# Altium project DspControlBoard.PrjPcb
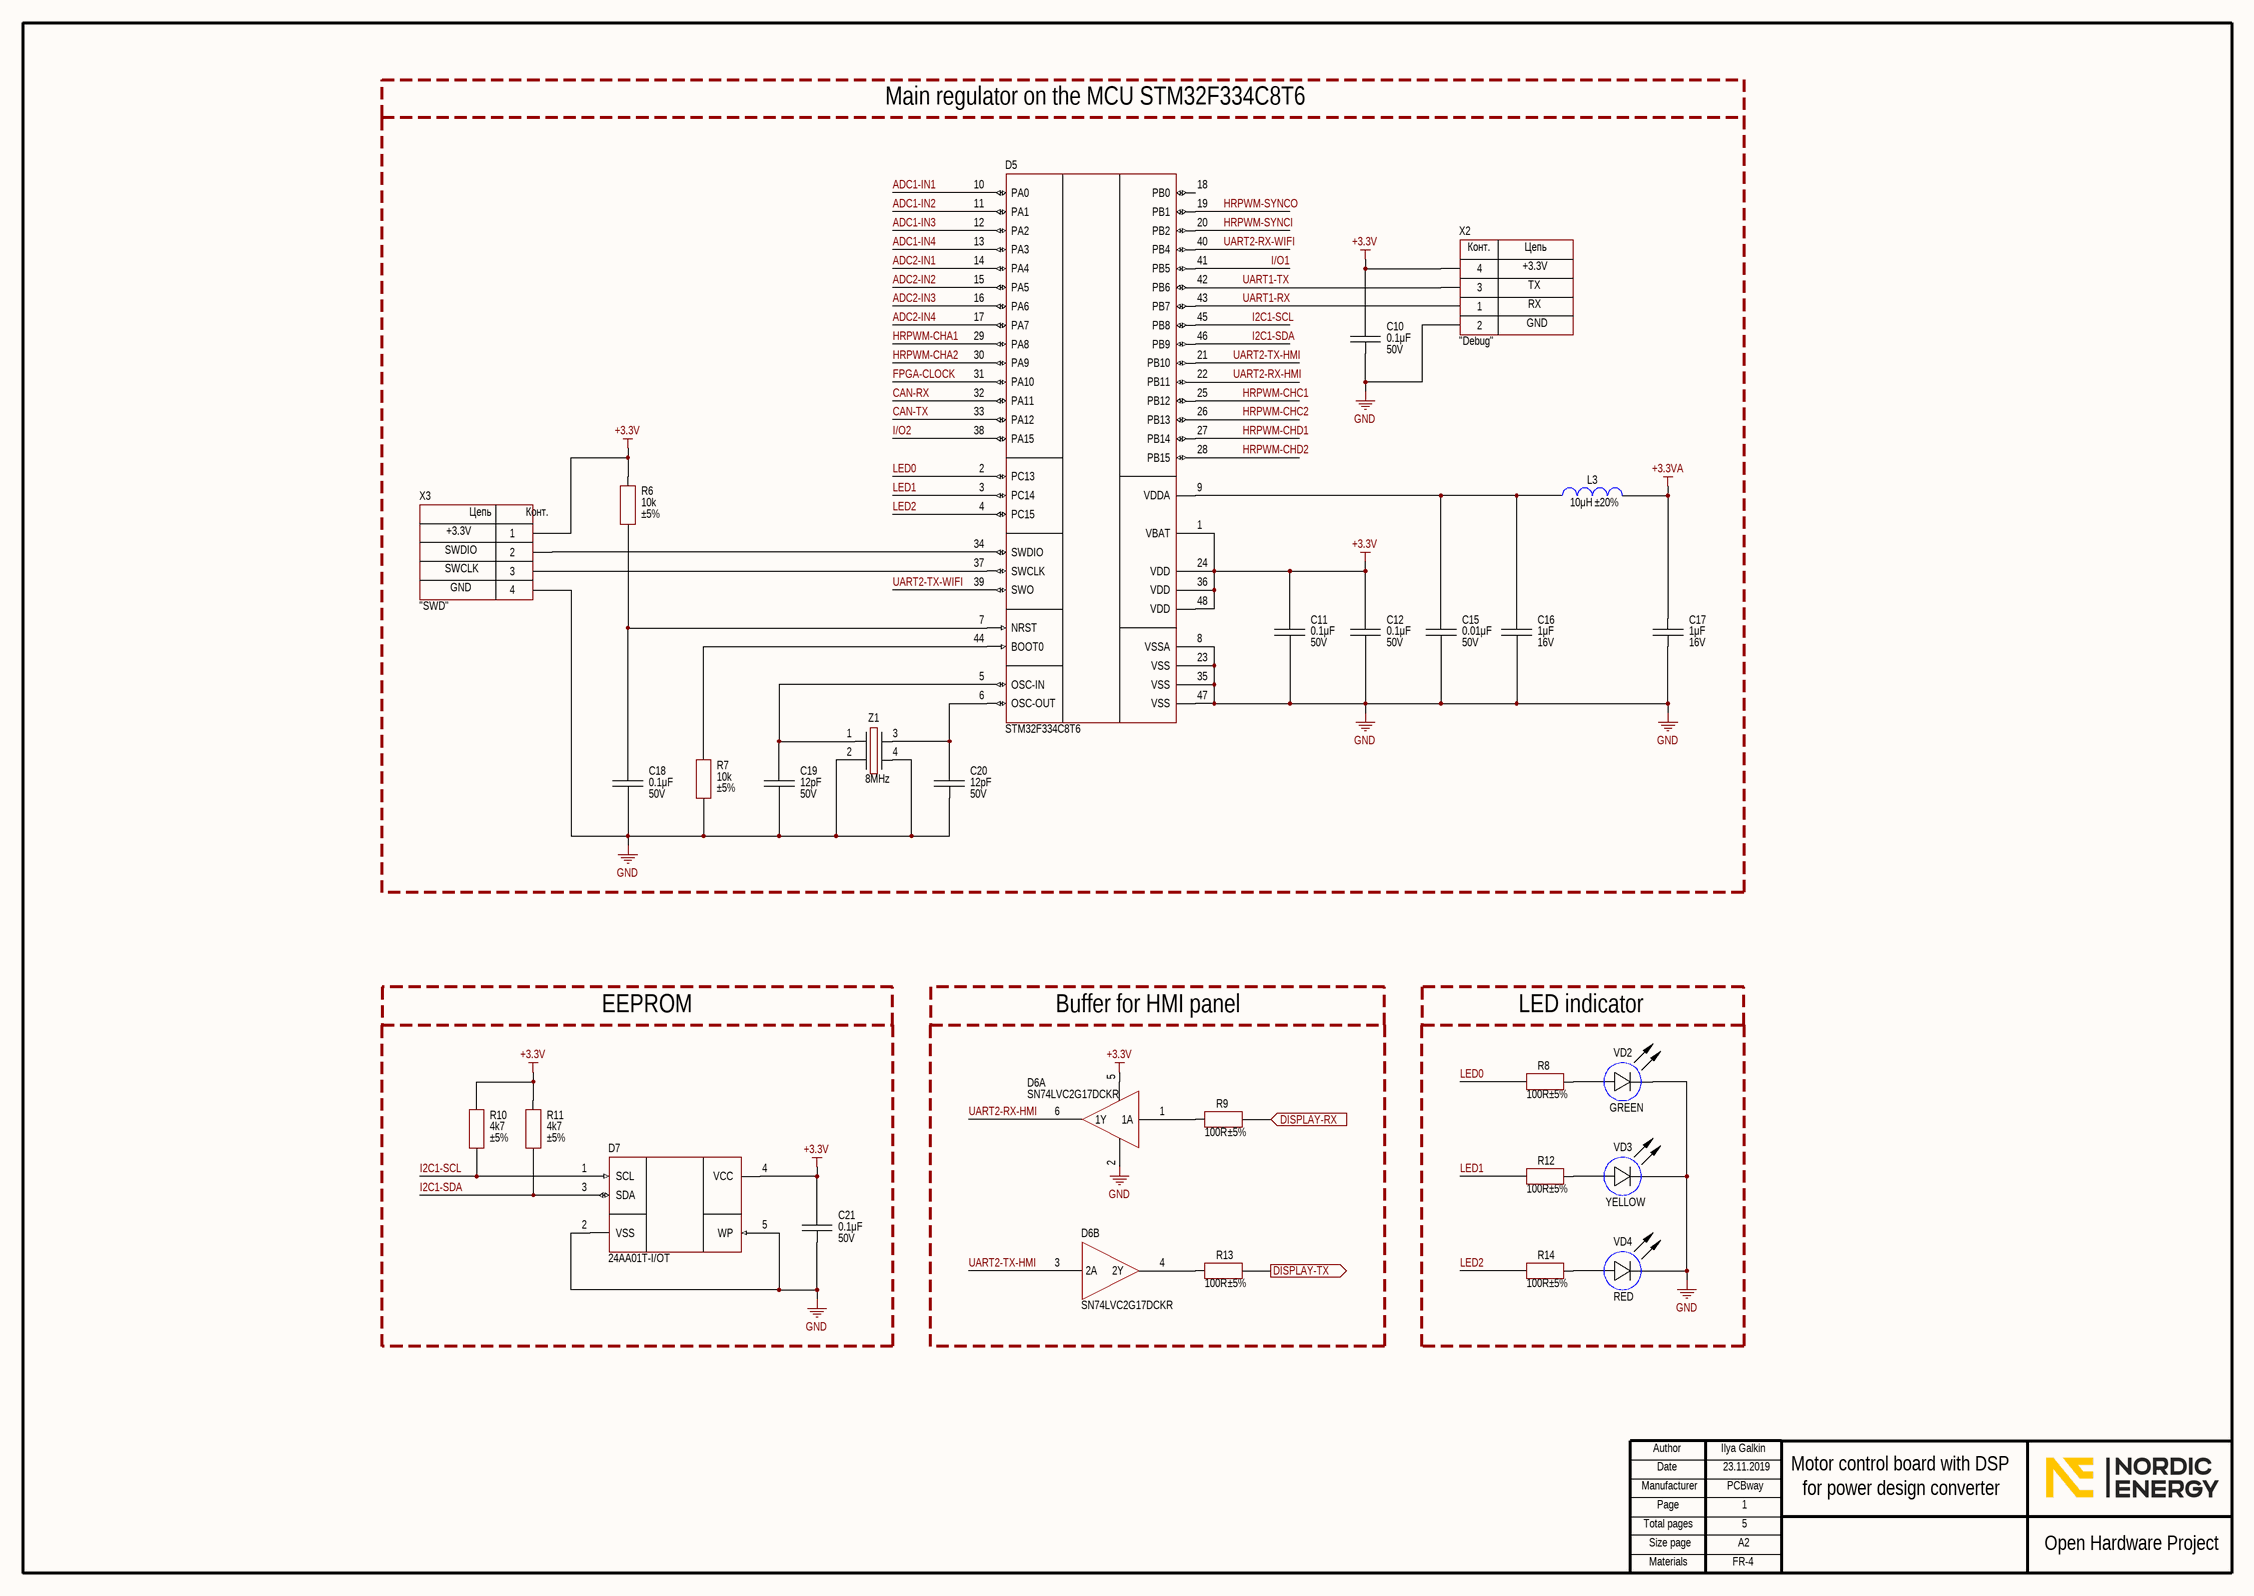
[diagram p0: ControllerDSP.SchDoc]
5 sheets, 113 parts. Net scope: global (net labels, ports and power ports of the same name join across sheets).
Board file: PcbFotControlBoard.PcbDoc
Sheets:
  ControllerDSP.SchDoc
  ProtectionADC.SchDoc
  WiFi.SchDoc
  ProtectionCPLD.SchDoc
  CanAndSupply.SchDoc

## Sheet ControllerDSP.SchDoc
size 594 x 420 mm; Address1: Address1; Address2: Address2; Address3: Address3; Address4: Address4; DocumentNumber: АБВГ.123456.001 Э3; SheetNumber: 1; SheetTotal: 5; Scale: 1:1; DocumentType: Схема электрическая принципиальная; FirstReferrence: АБВГ.123456.001

### Parts
C10  value 0.1μF  Voltage: 50V  [CAP: 0603]
C11  value 0.1μF  Voltage: 50V  [CAP: 0603]
C12  value 0.1μF  Voltage: 50V  [CAP: 0603]
C15  value 0.01μF  Voltage: 50V  [CAP: 0603]
C16  value 1μF  Voltage: 16V  [CAP: 0603]
C17  value 1μF  Voltage: 16V  [CAP: 0603]
C18  value 0.1μF  Voltage: 50V  [CAP: 0603]
C19  value 12pF  Voltage: 50V  [CAP: 0603]
C20  value 12pF  Voltage: 50V  [CAP: 0603]
C21  value 0.1μF  Voltage: 50V  [CAP: 0603]
D5  (no value)  [48-LQFP]
D6  (no value)  [SC70-6]  (parts A,B of 2)
D7  PartNumber: 24AA01T-I/OT  [SOT23-5]
L3  value 10μH  Tolerance: ±20%  [IND: 0603]
R6  value 10k  Tolerance: ±5%  [RES: 0603]
R7  value 10k  Tolerance: ±5%  [RES: 0603]
R8  value 100R  Tolerance: ±5%  [RES: 0603]
R9  value 100R  Tolerance: ±5%  [RES: 0603]
R10  value 4k7  Tolerance: ±5%  [RES: 0603]
R11  value 4k7  Tolerance: ±5%  [RES: 0603]
R12  value 100R  Tolerance: ±5%  [RES: 0603]
R13  value 100R  Tolerance: ±5%  [RES: 0603]
R14  value 100R  Tolerance: ±5%  [RES: 0603]
VD2  Color: GREEN  [LED: 0603G]
VD3  Color: YELLOW  [LED: 0603Y]
VD4  Color: RED  [LED: 0603R]
X2  CommentText: "Debug"  [CON: PBD-4]
X3  CommentText: "SWD"  [CON: SM04B-GHS]
Z1  Frequency: 8MHz  [OSC: 3225]

### Blocks framed on the sheet
Main regulator on the MCU STM32F334C8T6: C10-C12 C15-C20 D5 L3 R6 R7 X2 X3 Z1
EEPROM: C21 D7 R10 R11
Buffer for HMI panel: D6 R9 R13
LED indicator: R8 R12 R14 VD2-VD4

### Ports
DISPLAY-RX (in), DISPLAY-TX (out)

### Nets
+3.3V: C10.2 C11.2 C12.2 C21.2 D5.1(VBAT) D5.24(VDD) D5.36(VDD) D5.48(VDD) D6.5 D7.4(VCC) R6.2 R10.2 R11.2 X2.4 X3.1
+3.3VA: C17.2 L3.1
GND: C10.1 C11.1 C12.1 C15.1 C16.1 C17.1 C18.1 C19.1 C20.1 C21.1 D5.8(VSSA) D5.23(VSS) D5.35(VSS) D5.47(VSS) D6.2 D7.2(VSS) D7.5(WP) R7.1 VD2.2(C) VD3.2(C) VD4.2(C) X2.2 X3.4 Z1.2 Z1.4
ADC1-IN1: D5.10(PA0)
ADC1-IN2: D5.11(PA1)
ADC1-IN3: D5.12(PA2)
ADC1-IN4: D5.13(PA3)
ADC2-IN1: D5.14(PA4)
ADC2-IN2: D5.15(PA5)
ADC2-IN3: D5.16(PA6)
ADC2-IN4: D5.17(PA7)
CAN-RX: D5.32(PA11)
CAN-TX: D5.33(PA12)
FPGA-CLOCK: D5.31(PA10)
HRPWM-CHA1: D5.29(PA8)
HRPWM-CHA2: D5.30(PA9)
HRPWM-CHC1: D5.25(PB12)
HRPWM-CHC2: D5.26(PB13)
HRPWM-CHD1: D5.27(PB14)
HRPWM-CHD2: D5.28(PB15)
HRPWM-SYNCI: D5.20(PB2)
HRPWM-SYNCO: D5.19(PB1)
I2C1-SCL: D5.45(PB8) D7.1(SCL) R10.1
I2C1-SDA: D5.46(PB9) D7.3(SDA) R11.1
I/O1: D5.41(PB5)
I/O2: D5.38(PA15)
LED0: D5.2(PC13) R8.1
LED1: D5.3(PC14) R12.1
LED2: D5.4(PC15) R14.1
UART1-RX: D5.43(PB7) X2.1
UART1-TX: D5.42(PB6) X2.3
UART2-RX-HMI: D5.22(PB11) D6.6(1Y)
UART2-RX-WIFI: D5.40(PB4)
UART2-TX-HMI: D5.21(PB10) D6.3(2A)
UART2-TX-WIFI: D5.39(SWO)
NetC15_2: C15.2 C16.2 D5.9(VDDA) L3.2
NetC18_2: C18.2 D5.7(NRST) R6.1
NetC19_2: C19.2 D5.5(OSC-IN) Z1.1
NetC20_2: C20.2 D5.6(OSC-OUT) Z1.3
NetD5_34: D5.34(SWDIO) X3.2
NetD5_37: D5.37(SWCLK) X3.3
NetD5_44: D5.44(BOOT0) R7.2
NetD6_1: D6.1(1A) R9.1
NetD6_4: D6.4(2Y) R13.1
NetR8_2: R8.2 VD2.1(A)
NetR9_2: R9.2 ; port DISPLAY-RX
NetR12_2: R12.2 VD3.1(A)
NetR13_2: R13.2 ; port DISPLAY-TX
NetR14_2: R14.2 VD4.1(A)

Not connected (* = marked no-connect by the designer): D5 18(PB0)

### Notes on the sheet
- SWDIO
- +3.3V
- SWCLK
- GND
- Ilya Galkin
- 23.11.2019
- PCBway
- 1
- Motor control board with DSP
- for power design converter
- 5
- FR-4
- Author
- Manufacturer
- Date
- Page
- Total pages
- Size page
- A2
- Open Hardware Project
- Materials
- (in symbol Connector_SM04B) Цепь; Конт.
- (in symbol Standard_Debug) Конт.; Цепь; +3.3V; TX; RX; GND

### Library data of the parts
C10-C12 C18 C21 = Ceramic_0603: Manufacturer: Samsung; PartNumber: CL10B104KB8NNNC; ValueManufacturerPartNumber: Ceramic capacitor, 0.1μF, X7R, ±10%, 50V, 0603, -55...+125°C; TypeCapacitor: Ceramic capacitor; Tolerance: ±10%; TypeDielectric: X7R; Package: 0603; HelpURL: https://www.digikey.com/product-detail/en/samsung-electro-mechanics/CL10B104KB8NNNC/1276-1000-1-ND/3889086; Temperature: -55...+125°C
C15 = Ceramic_0603: Manufacturer: Samsung; PartNumber: CL10B103KB8NNNC; ValueManufacturerPartNumber: Ceramic capacitor, 0.01μF, X7R, ±10%, 50V, 0603, -55...+125°C; TypeCapacitor: Ceramic capacitor; Tolerance: ±10%; TypeDielectric: X7R; Package: 0603; HelpURL: https://www.digikey.com/product-detail/en/samsung-electro-mechanics/CL10B103KB8NNNC/1276-1009-1-ND/3889095; Temperature: -55...+125°C
C16 C17 = Ceramic_0603: Manufacturer: Samsung; PartNumber: CL10B105KO8NNNC; ValueManufacturerPartNumber: Ceramic capacitor, 1μF, X7R, ±10%, 16V, 0603, -55...+125°C; TypeCapacitor: Ceramic capacitor; Tolerance: ±10%; TypeDielectric: X7R; Package: 0603; HelpURL: https://www.digikey.com/product-detail/en/samsung-electro-mechanics/CL10B105KO8NNNC/1276-1019-1-ND/3889105; Temperature: -55...+125°C
C19 C20 = Ceramic_0603: Manufacturer: Samsung; PartNumber: CL10C120JB8NNNC; ValueManufacturerPartNumber: Ceramic capacitor, 12pF, NPO, ±10%, 50V, 0603, -55...+125°C; TypeCapacitor: Ceramic capacitor; Tolerance: ±10%; TypeDielectric: NPO; Package: 0603; HelpURL: https://www.digikey.com/product-detail/en/samsung-electro-mechanics/CL10C120JB8NNNC/1276-1254-1-ND/3889340; Temperature: -55...+125°C
D5 = STM32F334C8T6: Cortex-M4; Manufacturer: STMicroelectronics; ValueManufacturerPartNumber: IC microcontroller, 32-Bit, Cortex-M4, 72MHz, 64KB, 12KB, 2...3.6V, -40...+85°C, 48-LQFP; Supply: 2...3.6V; Speed: 72MHz; CoreSize: 32-Bit; MemoryROM: 64KB; MemoryRAM: 12KB; HelpURL: https://www.digikey.com/products/en?keywords=STM32F334C8T6; Package: 48-LQFP; ComponentType: IC microcontroller; Temperature: -40...+85°C; CoreProcessor: Cortex-M4; PartNumber: STM32F334C8T6
D6 = SN74LVC2G17DCKR: Buffer; Manufacturer: Texas Instruments; ValueManufacturerPartNumber: IC logic buffer, 1.65...5.5V, -40...+125°C, SC-70-6; Supply: 1.65...5.5V; HelpURL: https://www.digikey.com/product-detail/en/texas-instruments/SN74LVC2G17DCKR/296-13013-1-ND/479736; Package: SC-70-6; ComponentType: IC logic buffer; Temperature: -40...+125°C; PartNumber: SN74LVC2G17DCKR
D7 = 24AA01T: EEPROM; Manufacturer: Microchip Technology; ValueManufacturerPartNumber: IC memory, EEPROM, 1KB (128x8), 400 kHz, I2C, 1.7...5.5V, -40...+85°C, SOT-23-5; Supply: 1.7...5.5V; Speed: 400 kHz; InterfaceData: I2C; MemorySize: 1KB (128x8); HelpURL: https://www.digikey.com/product-detail/en/microchip-technology/24AA01T-I-OT/24AA01T-I-OTCT-ND/857670; Package: SOT-23-5; ComponentType: IC memory; Temperature: -40...+85°C; MemoryType: EEPROM
L3 = Inductor_0603: Manufacturer: Murata Electronics; PartNumber: LQM18FN100M00D; ValueManufacturerPartNumber: Fixed inductor, 10μH, ±20%, 0603, 50mA, -55...+125°C; TypeInductor: Fixed inductor; MaxCurrent: 50mA; Package: 0603; HelpURL: https://www.digikey.com/product-detail/en/murata-electronics-north-america/LQM18FN100M00D/490-4025-1-ND/1016285; Temperature: -55...+125°C
R6 R7 = Resistor_0603: Manufacturer: Yageo; PartNumber: RC0603JR-0710KL; ValueManufacturerPartNumber: Resistor film, 10k, ±5%, 0603, 0.1W, -55...+125°C; TypeResistor: Resistor film; Power: 0.1W; Package: 0603; HelpURL: https://www.digikey.com/product-detail/en/yageo/RC0603JR-0710KL/311-10KGRCT-ND/729647; Temperature: -55...+125°C
R8 R9 R12-R14 = Resistor_0603: Manufacturer: Yageo; PartNumber: RC0603JR-07100RL; ValueManufacturerPartNumber: Resistor film, 100R, ±5%, 0603, 0.1W, -55...+125°C; TypeResistor: Resistor film; Power: 0.1W; Package: 0603; HelpURL: https://www.digikey.com/product-detail/en/yageo/RC0603JR-07100RL/311-100GRCT-ND/729644; Temperature: -55...+125°C
R10 R11 = Resistor_0603: Manufacturer: Yageo; PartNumber: RC0603JR-074K7L; ValueManufacturerPartNumber: Resistor film, 4k7, ±5%, 0603, 0.1W, -55...+125°C; TypeResistor: Resistor film; Power: 0.1W; Package: 0603; HelpURL: https://www.digikey.com/product-detail/en/yageo/RC0603JR-074K7L/311-4.7KGRCT-ND/729732; Temperature: -55...+125°C
VD2 = LED_single: Manufacturer: Wurth; ValueManufacturerPartNumber: LED, Green, 20mA, 2V, 0603, -55...+150°C; PartNumber: 150060VS75000; TypeDiode: LED; Current: 20mA; VoltageDrop: 2V; Package: 0603; HelpURL: https://www.digikey.com/product-detail/en/wurth-electronics-inc/150060VS75000/732-4980-1-ND/4489904; Temperature: -55...+150°C; ColorParameter: Green
VD3 = LED_single: Manufacturer: Wurth; ValueManufacturerPartNumber: LED, Yellow, 20mA, 2V, 0603, -55...+150°C; PartNumber: 150060YS75000; TypeDiode: LED; Current: 20mA; VoltageDrop: 2V; Package: 0603; HelpURL: https://www.digikey.com/product-detail/en/wurth-electronics-inc/150060YS75000/732-4981-1-ND/4489907; Temperature: -55...+150°C; ColorParameter: Yellow
VD4 = LED_single: Manufacturer: Wurth; ValueManufacturerPartNumber: LED, Red, 20mA, 2V, 0603, -55...+150°C; PartNumber: 150060RS55040; TypeDiode: LED; Current: 20mA; VoltageDrop: 2V; Package: 0603; HelpURL: https://www.digikey.com/product-detail/en/w-rth-elektronik/150060RS55040/732-12015-1-ND/8557225; Temperature: -55...+150°C; ColorParameter: Red
X2 = Standard_Debug: Manufacturer: Connfly; ValueManufacturerPartNumber: Connector, 4pin, 2.54mm, 500VAC, 3A; PartNumber: PBD-4; TypeConnector: Connector; VoltageMax: 500VAC; Pitch: 2.54mm; CurrentMax: 3A; Multichannel: 4pin; HelpURL: https://www.chipdip.ru/product/pbd-4
X3 = Connector_SM04B: Manufacturer: JST; ValueManufacturerPartNumber: Connector, 4pin, 1.25mm, 50VDC, 1A; PartNumber: SM04B-GHS; VoltageMax: 50VDC; Pitch: 1.25mm; CurrentMax: 1A; Multichannel: 4pin; HelpURL: https://www.digikey.com/product-detail/en/jst-sales-america-inc/SM04B-GHS-TB-LF-SN/455-1566-1-ND/807834; TypeConnector: Connector
Z1 = Crystal_3225: Manufacturer: Diodes Incorporated; PartNumber: FL0800008Q; ValueManufacturerPartNumber: Crystal, 8MHz, 12pF, ±30ppm, case 3225, -40...+85°C; LoadCapacitance: 12pF; Tolerance: ±30ppm; Package: case 3225; HelpURL: https://www.digikey.com/product-detail/en/diodes-incorporated/FL0800008Q/FL0800008QDICT-ND/9952912; Temperature: -40...+85°C; TypeOscilator: Crystal

## Sheet ProtectionADC.SchDoc
size 420 x 297 mm; Address1: Address1; Address2: Address2; Address3: Address3; Address4: Address4; DocumentNumber: АБВГ.123456.001 Э3; SheetNumber: 2; SheetTotal: 5; Scale: 1:1; DocumentType: Схема электрическая принципиальная; FirstReferrence: АБВГ.123456.001
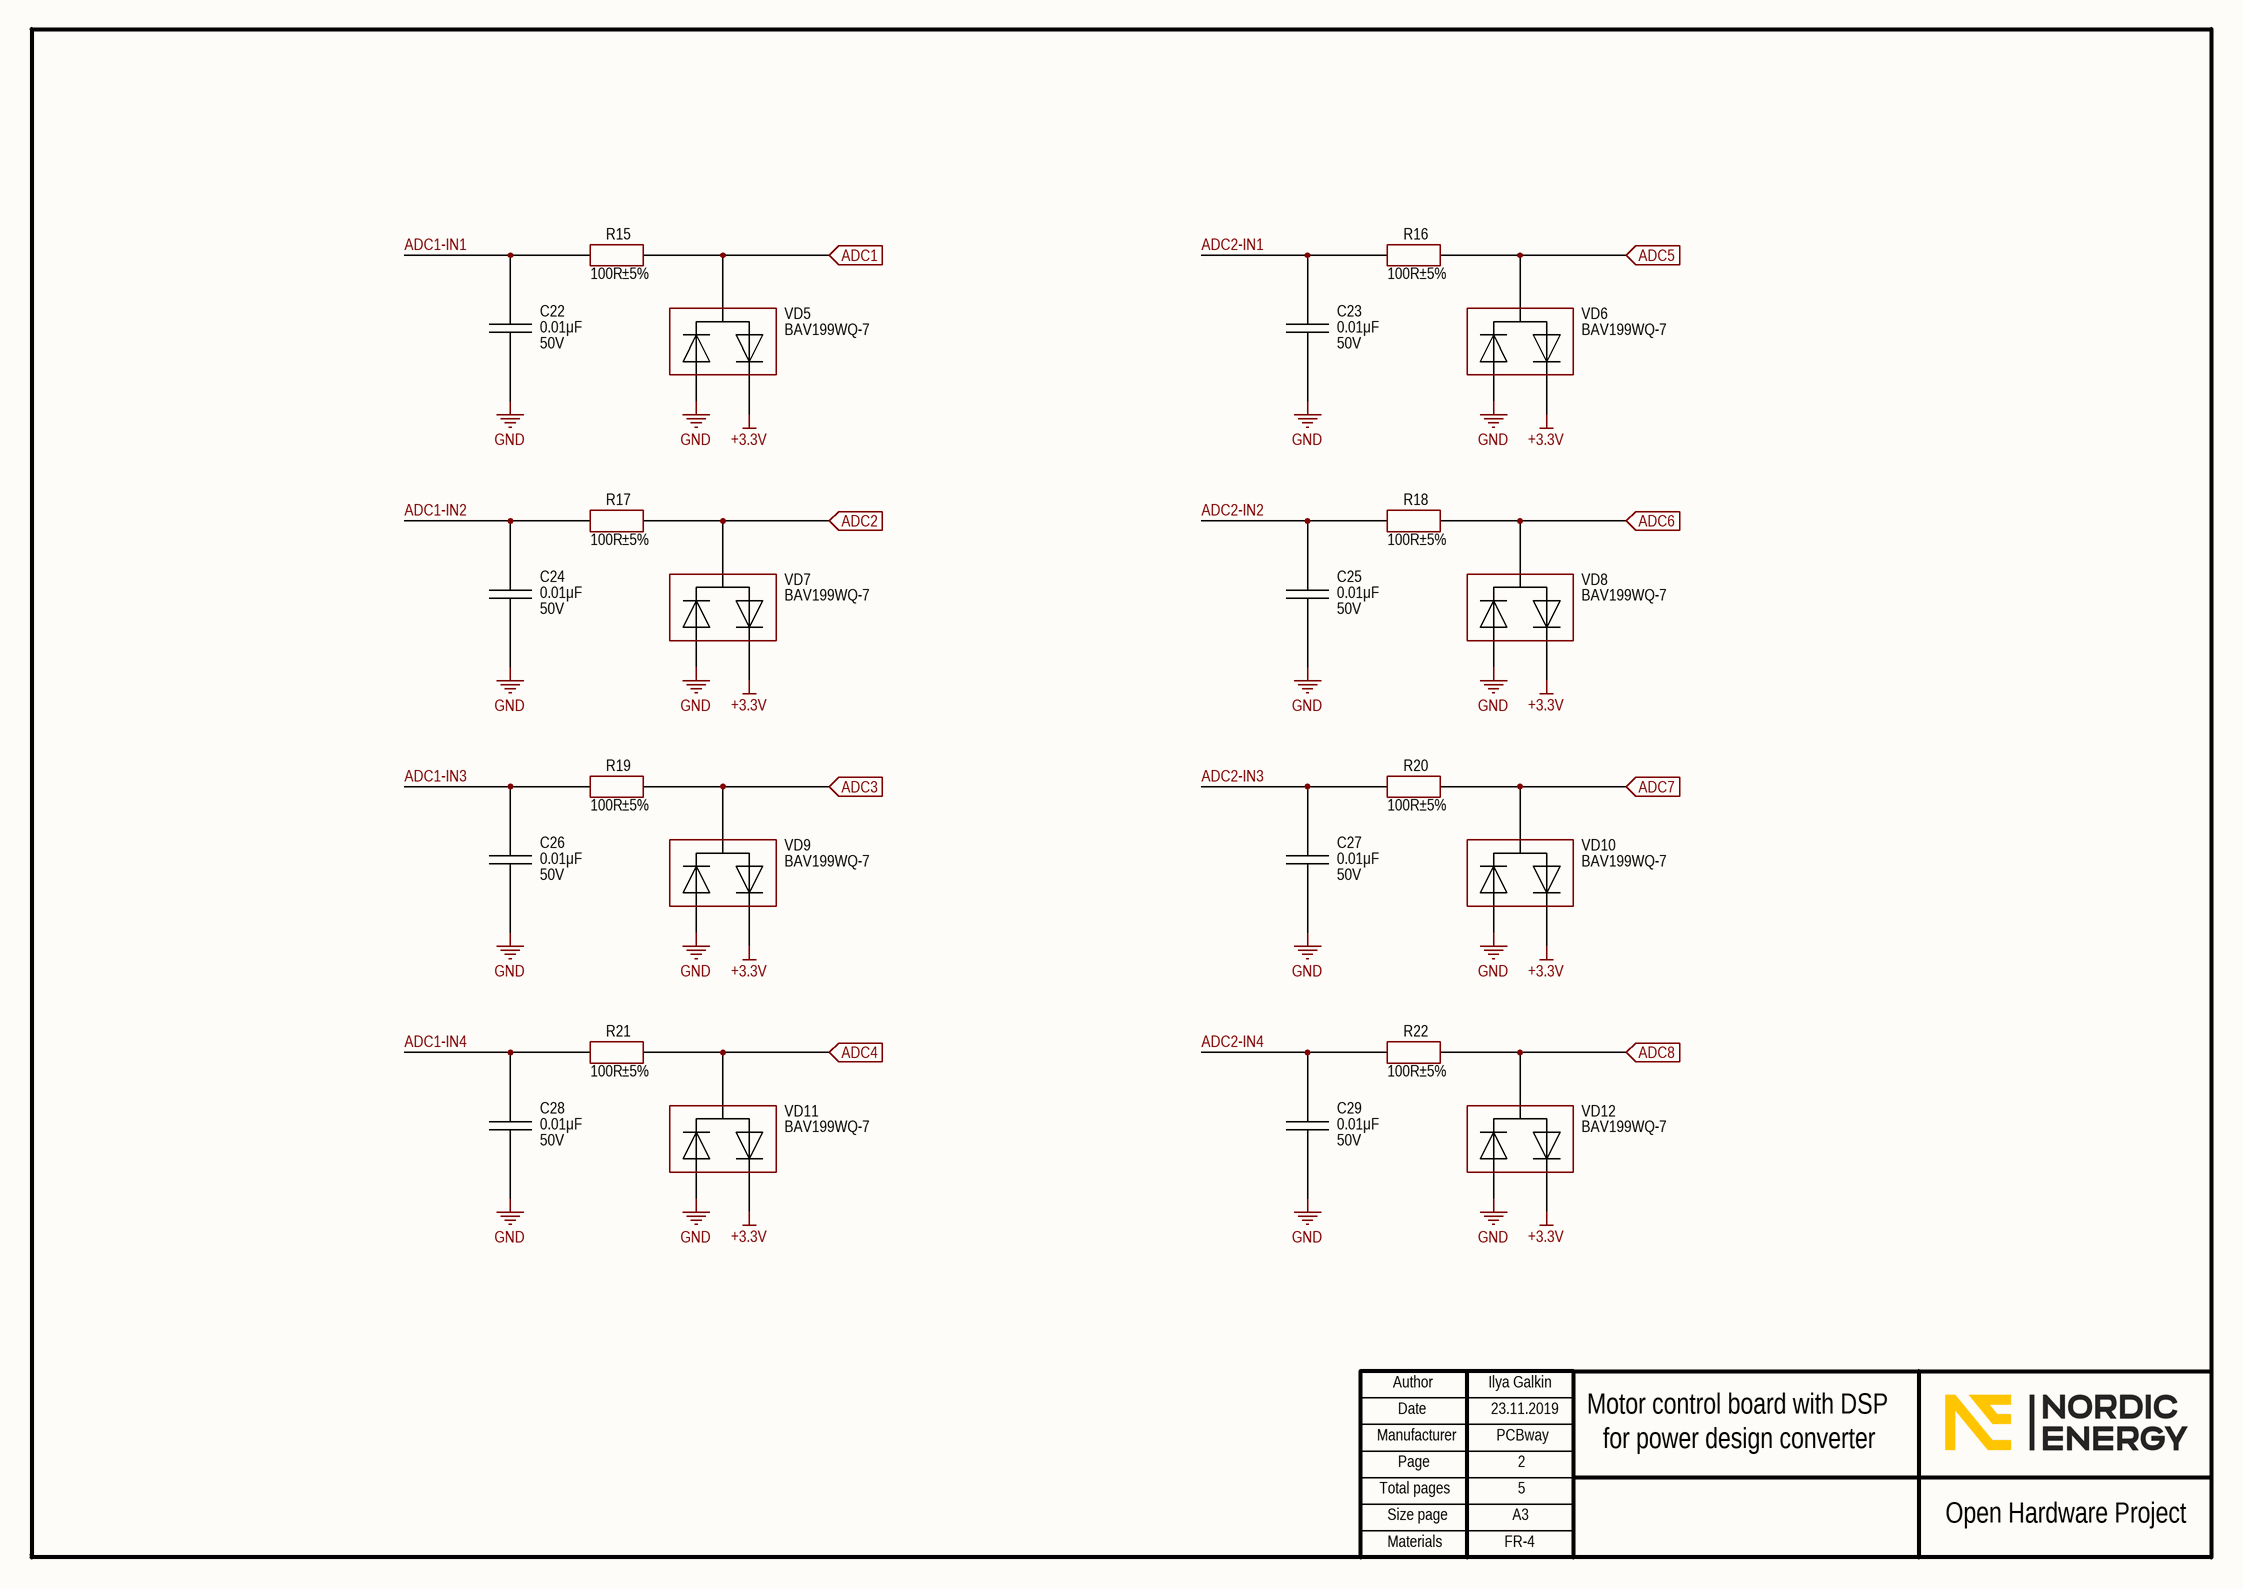
[diagram p1: ProtectionADC.SchDoc]

### Parts
C22  value 0.01μF  Voltage: 50V  [CAP: 0603]
C23  value 0.01μF  Voltage: 50V  [CAP: 0603]
C24  value 0.01μF  Voltage: 50V  [CAP: 0603]
C25  value 0.01μF  Voltage: 50V  [CAP: 0603]
C26  value 0.01μF  Voltage: 50V  [CAP: 0603]
C27  value 0.01μF  Voltage: 50V  [CAP: 0603]
C28  value 0.01μF  Voltage: 50V  [CAP: 0603]
C29  value 0.01μF  Voltage: 50V  [CAP: 0603]
R15  value 100R  Tolerance: ±5%  [RES: 0603]
R16  value 100R  Tolerance: ±5%  [RES: 0603]
R17  value 100R  Tolerance: ±5%  [RES: 0603]
R18  value 100R  Tolerance: ±5%  [RES: 0603]
R19  value 100R  Tolerance: ±5%  [RES: 0603]
R20  value 100R  Tolerance: ±5%  [RES: 0603]
R21  value 100R  Tolerance: ±5%  [RES: 0603]
R22  value 100R  Tolerance: ±5%  [RES: 0603]
VD5  PartNumber: BAV199WQ-7  [SC-70]
VD6  PartNumber: BAV199WQ-7  [SC-70]
VD7  PartNumber: BAV199WQ-7  [SC-70]
VD8  PartNumber: BAV199WQ-7  [SC-70]
VD9  PartNumber: BAV199WQ-7  [SC-70]
VD10  PartNumber: BAV199WQ-7  [SC-70]
VD11  PartNumber: BAV199WQ-7  [SC-70]
VD12  PartNumber: BAV199WQ-7  [SC-70]

### Ports
ADC1 (in), ADC2 (in), ADC3 (in), ADC4 (in), ADC5 (in), ADC6 (in), ADC7 (in), ADC8 (in)

### Nets
+3.3V: VD5.2 VD6.2 VD7.2 VD8.2 VD9.2 VD10.2 VD11.2 VD12.2
GND: C22.1 C23.1 C24.1 C25.1 C26.1 C27.1 C28.1 C29.1 VD5.1 VD6.1 VD7.1 VD8.1 VD9.1 VD10.1 VD11.1 VD12.1
ADC1-IN1: C22.2 R15.1
ADC1-IN2: C24.2 R17.1
ADC1-IN3: C26.2 R19.1
ADC1-IN4: C28.2 R21.1
ADC2-IN1: C23.2 R16.1
ADC2-IN2: C25.2 R18.1
ADC2-IN3: C27.2 R20.1
ADC2-IN4: C29.2 R22.1
NetR15_2: R15.2 VD5.3 ; port ADC1
NetR16_2: R16.2 VD6.3 ; port ADC5
NetR17_2: R17.2 VD7.3 ; port ADC2
NetR18_2: R18.2 VD8.3 ; port ADC6
NetR19_2: R19.2 VD9.3 ; port ADC3
NetR20_2: R20.2 VD10.3 ; port ADC7
NetR21_2: R21.2 VD11.3 ; port ADC4
NetR22_2: R22.2 VD12.3 ; port ADC8

### Notes on the sheet
- Ilya Galkin
- 23.11.2019
- PCBway
- 2
- Motor control board with DSP
- for power design converter
- 5
- FR-4
- Author
- Manufacturer
- Date
- Page
- Total pages
- Size page
- A3
- Open Hardware Project
- Materials

### Library data of the parts
C22-C29 = Ceramic_0603: as C15 on sheet ControllerDSP; Package: 0603; HelpURL: https://www.digikey.com/product-detail/en/samsung-electro-mechanics/CL10B103KB8NNNC/1276-1009-1-ND/3889095; Temperature: -55...+125°C
R15-R22 = Resistor_0603: as R8 on sheet ControllerDSP; Package: 0603; HelpURL: https://www.digikey.com/product-detail/en/yageo/RC0603JR-07100RL/311-100GRCT-ND/729644; Temperature: -55...+125°C
VD5-VD12 = Diode_array: Manufacturer: Diodes Incorporated; ValueManufacturerPartNumber: Diode array, 85V, 140mA, 1.1V, 3us, SC-70, -65...+150°C; TypeDiode: Diode array; Voltage: 85V; Current: 140mA; VoltageDrop: 1.1V; RecoveryTime: 3us; Package: SC-70; HelpURL: https://www.digikey.com/product-detail/en/diodes-incorporated/BAV199WQ-7/BAV199WQ-7DICT-ND/6003950; Temperature: -65...+150°C

## Sheet WiFi.SchDoc
size 420 x 297 mm; Address1: Address1; Address2: Address2; Address3: Address3; Address4: Address4; DocumentNumber: АБВГ.123456.001 Э3; SheetNumber: 3; SheetTotal: 5; Scale: 1:1; DocumentType: Схема электрическая принципиальная; FirstReferrence: АБВГ.123456.001
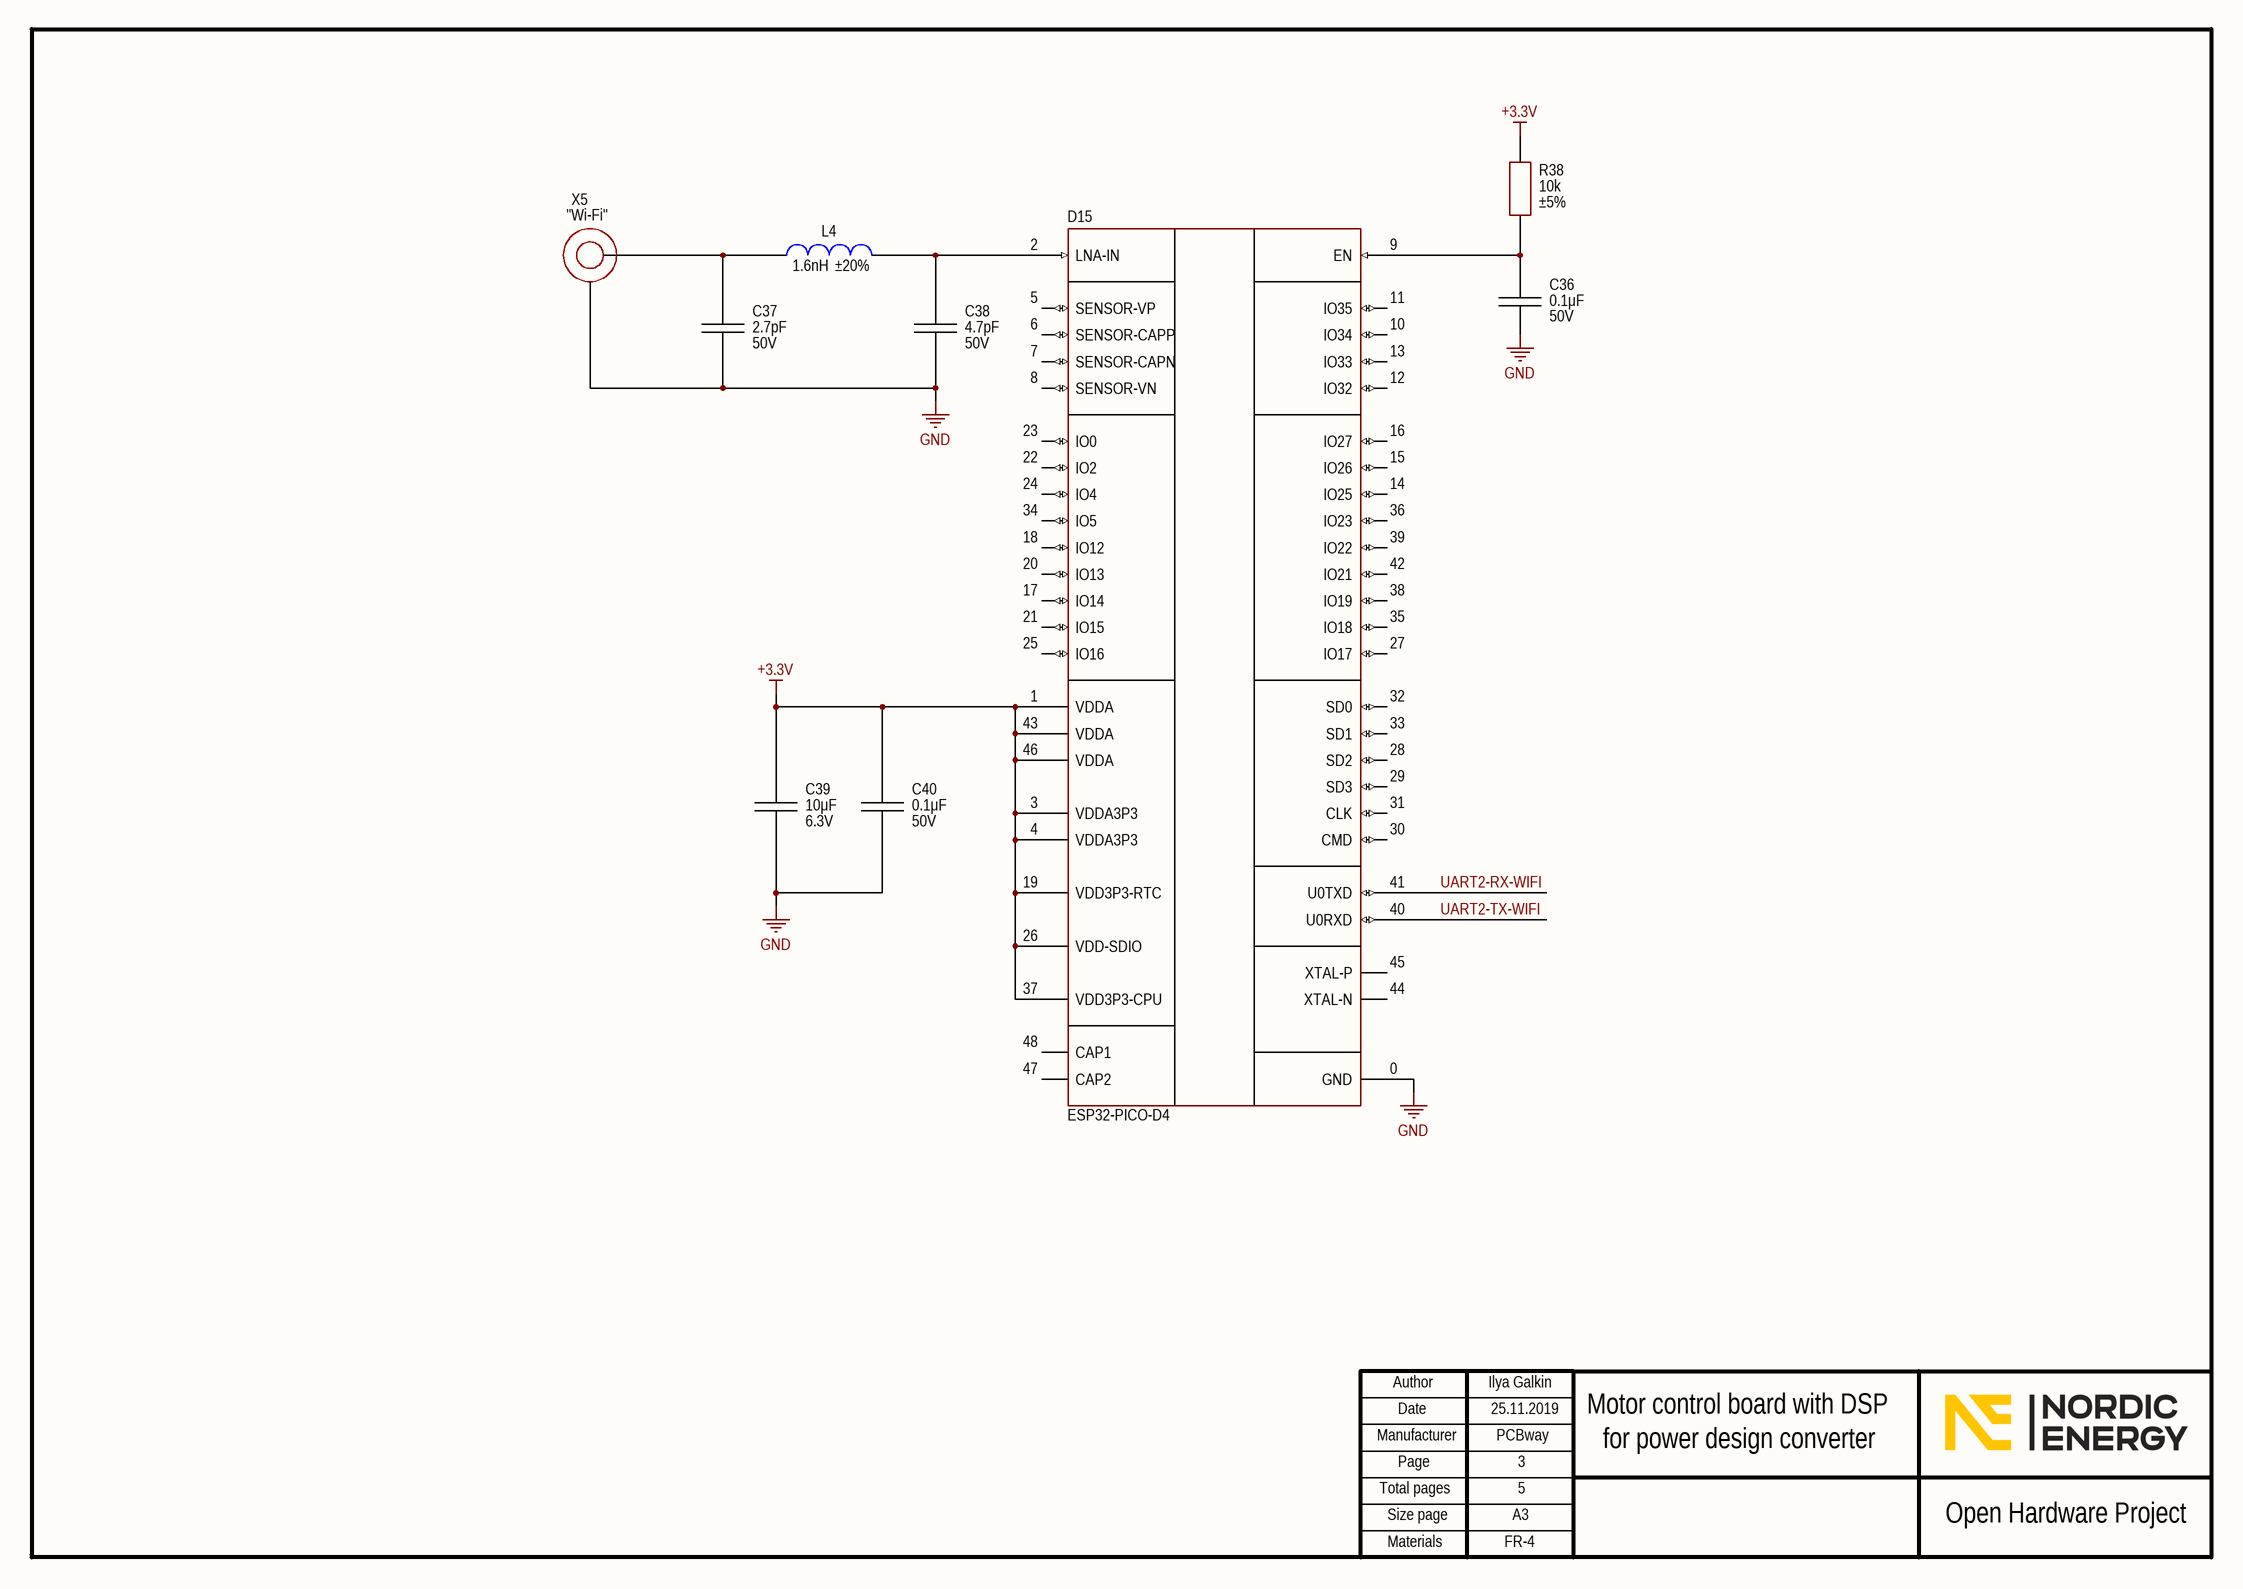
[diagram p2: WiFi.SchDoc]

### Parts
C36  value 0.1μF  Voltage: 50V  [CAP: 0603]
C37  value 2.7pF  Voltage: 50V  [CAP: 0603]
C38  value 4.7pF  Voltage: 50V  [CAP: 0603]
C39  value 10μF  Voltage: 6.3V  [CAP: 0603]
C40  value 0.1μF  Voltage: 50V  [CAP: 0603]
D15  (no value)  [48-LGA (7x7)]
L4  value 1.6nH  Tolerance: ±20%  [IND: 0603]
R38  value 10k  Tolerance: ±5%  [RES: 0603]
X5  CommentText: "Wi-Fi"  [CON: u.Fl]

### Nets
+3.3V: C39.2 C40.2 D15.1(VDDA) D15.3(VDDA3P3) D15.4(VDDA3P3) D15.19(VDD3P3-RTC) D15.26(VDD-SDIO) D15.37(VDD3P3-CPU) D15.43(VDDA) D15.46(VDDA) R38.2
GND: C36.1 C37.1 C38.1 C39.1 C40.1 D15.0(GND) X5.2
UART2-RX-WIFI: D15.41(U0TXD)
UART2-TX-WIFI: D15.40(U0RXD)
NetC36_2: C36.2 D15.9(EN) R38.1
NetC37_2: C37.2 L4.2 X5.1
NetC38_2: C38.2 D15.2(LNA-IN) L4.1

Not connected (* = marked no-connect by the designer): D15 5(SENSOR-VP) 6(SENSOR-CAPP) 7(SENSOR-CAPN) 8(SENSOR-VN) 10(IO34) 11(IO35) 12(IO32) 13(IO33) 14(IO25) 15(IO26) 16(IO27) 17(IO14) 18(IO12) 20(IO13) 21(IO15) 22(IO2) 23(IO0) 24(IO4) 25(IO16) 27(IO17) 28(SD2) 29(SD3) 30(CMD) 31(CLK) 32(SD0) 33(SD1) 34(IO5) 35(IO18) 36(IO23) 38(IO19) 39(IO22) 42(IO21) 44(XTAL-N) 45(XTAL-P) 47(CAP2) 48(CAP1)

### Notes on the sheet
- Ilya Galkin
- 25.11.2019
- PCBway
- 3
- Motor control board with DSP
- for power design converter
- 5
- FR-4
- Author
- Manufacturer
- Date
- Page
- Total pages
- Size page
- A3
- Open Hardware Project
- Materials

### Library data of the parts
C36 C40 = Ceramic_0603: as C10 on sheet ControllerDSP; Package: 0603; HelpURL: https://www.digikey.com/product-detail/en/samsung-electro-mechanics/CL10B104KB8NNNC/1276-1000-1-ND/3889086; Temperature: -55...+125°C
C37 = Ceramic_0603: Manufacturer: Samsung; PartNumber: CL10C2R7BB8NNNC; ValueManufacturerPartNumber: Ceramic capacitor, 2.7pF, NPO, ±10%, 50V, 0603, -55...+125°C; TypeCapacitor: Ceramic capacitor; Tolerance: ±10%; TypeDielectric: NPO; Package: 0603; HelpURL: https://www.digikey.com/product-detail/en/samsung-electro-mechanics/CL10C2R7BB8NNNC/1276-1240-1-ND/3889326; Temperature: -55...+125°C
C38 = Ceramic_0603: Manufacturer: Samsung; PartNumber: CL10C4R7CB8NNNC; ValueManufacturerPartNumber: Ceramic capacitor, 4.7pF, NPO, ±10%, 50V, 0603, -55...+125°C; TypeCapacitor: Ceramic capacitor; Tolerance: ±10%; TypeDielectric: NPO; Package: 0603; HelpURL: https://www.digikey.com/product-detail/en/samsung-electro-mechanics/CL10C4R7CB8NNNC/1276-1282-1-ND/3889368; Temperature: -55...+125°C
C39 = Ceramic_0603: Manufacturer: Samsung; PartNumber: CL10B106MQ8NRNC; ValueManufacturerPartNumber: Ceramic capacitor, 10μF, X7R, ±10%, 6.3V, 0603, -55...+125°C; TypeCapacitor: Ceramic capacitor; Tolerance: ±10%; TypeDielectric: X7R; Package: 0603; HelpURL: https://www.digikey.com/product-detail/en/samsung-electro-mechanics/CL10B106MQ8NRNC/1276-1948-1-ND/3890034; Temperature: -55...+125°C
D15 = ESP32-PICO-D4: Wi-Fi+BT; Manufacturer: Espressif Systems; ValueManufacturerPartNumber: IC RF transceiver, 802.11b/g/n + Bluetooth v4.2, 2.4GHz, 32-Bit, Xtensa LX6, 4Mb, 520KB, 2.7...3.6V, -40...+85°C, 48-LGA; Supply: 2.7...3.6V; CoreSpeed: 600 DMIPS; CoreSize: 32-Bit; MemoryROM: 4Mb; MemoryRAM: 520KB; CoreProcessor: Xtensa LX6; Frequency: 2.4GHz; TypeProtocol: 802.11b/g/n + Bluetooth v4.2; HelpURL: https://www.digikey.com/product-detail/en/espressif-systems/ESP32-PICO-D4/1904-1029-1-ND/9381738; Package: 48-LGA; ComponentType: IC RF transceiver; Temperature: -40...+85°C; PartNumber: ESP32-PICO-D4
L4 = Inductor_0603: Manufacturer: Bourns; PartNumber: CW161009A-1N6D; ValueManufacturerPartNumber: Fixed inductor, 1.6nH, ±20%, 0603, 700mA, -40...+125°C; TypeInductor: Fixed inductor; MaxCurrent: 700mA; Package: 0603; HelpURL: https://www.digikey.com/product-detail/en/bourns-inc/CW161009A-1N6D/CW161009A-1N6DCT-ND/9826842; Temperature: -40...+125°C
R38 = Resistor_0603: as R6 on sheet ControllerDSP; Package: 0603; HelpURL: https://www.digikey.com/product-detail/en/yageo/RC0603JR-0710KL/311-10KGRCT-ND/729647; Temperature: -55...+125°C
X5 = Connector_uFL: Manufacturer: Hirose Electric; ValueManufacturerPartNumber: Connector u.FL, 50 Ohm, 6GHz; PartNumber: U.FL-R-SMT(01); TypeConnector: Connector u.FL; Frequency: 6GHz; Impedance: 50 Ohm; HelpURL: https://www.digikey.com/product-detail/en/hirose-electric-co-ltd/U.FL-R-SMT-01/H9161-ND/513010

## Sheet ProtectionCPLD.SchDoc
size 594 x 420 mm; Address1: Address1; Address2: Address2; Address3: Address3; Address4: Address4; DocumentNumber: АБВГ.123456.001 Э3; SheetNumber: 4; SheetTotal: 5; Scale: 1:1; DocumentType: Схема электрическая принципиальная; FirstReferrence: АБВГ.123456.001
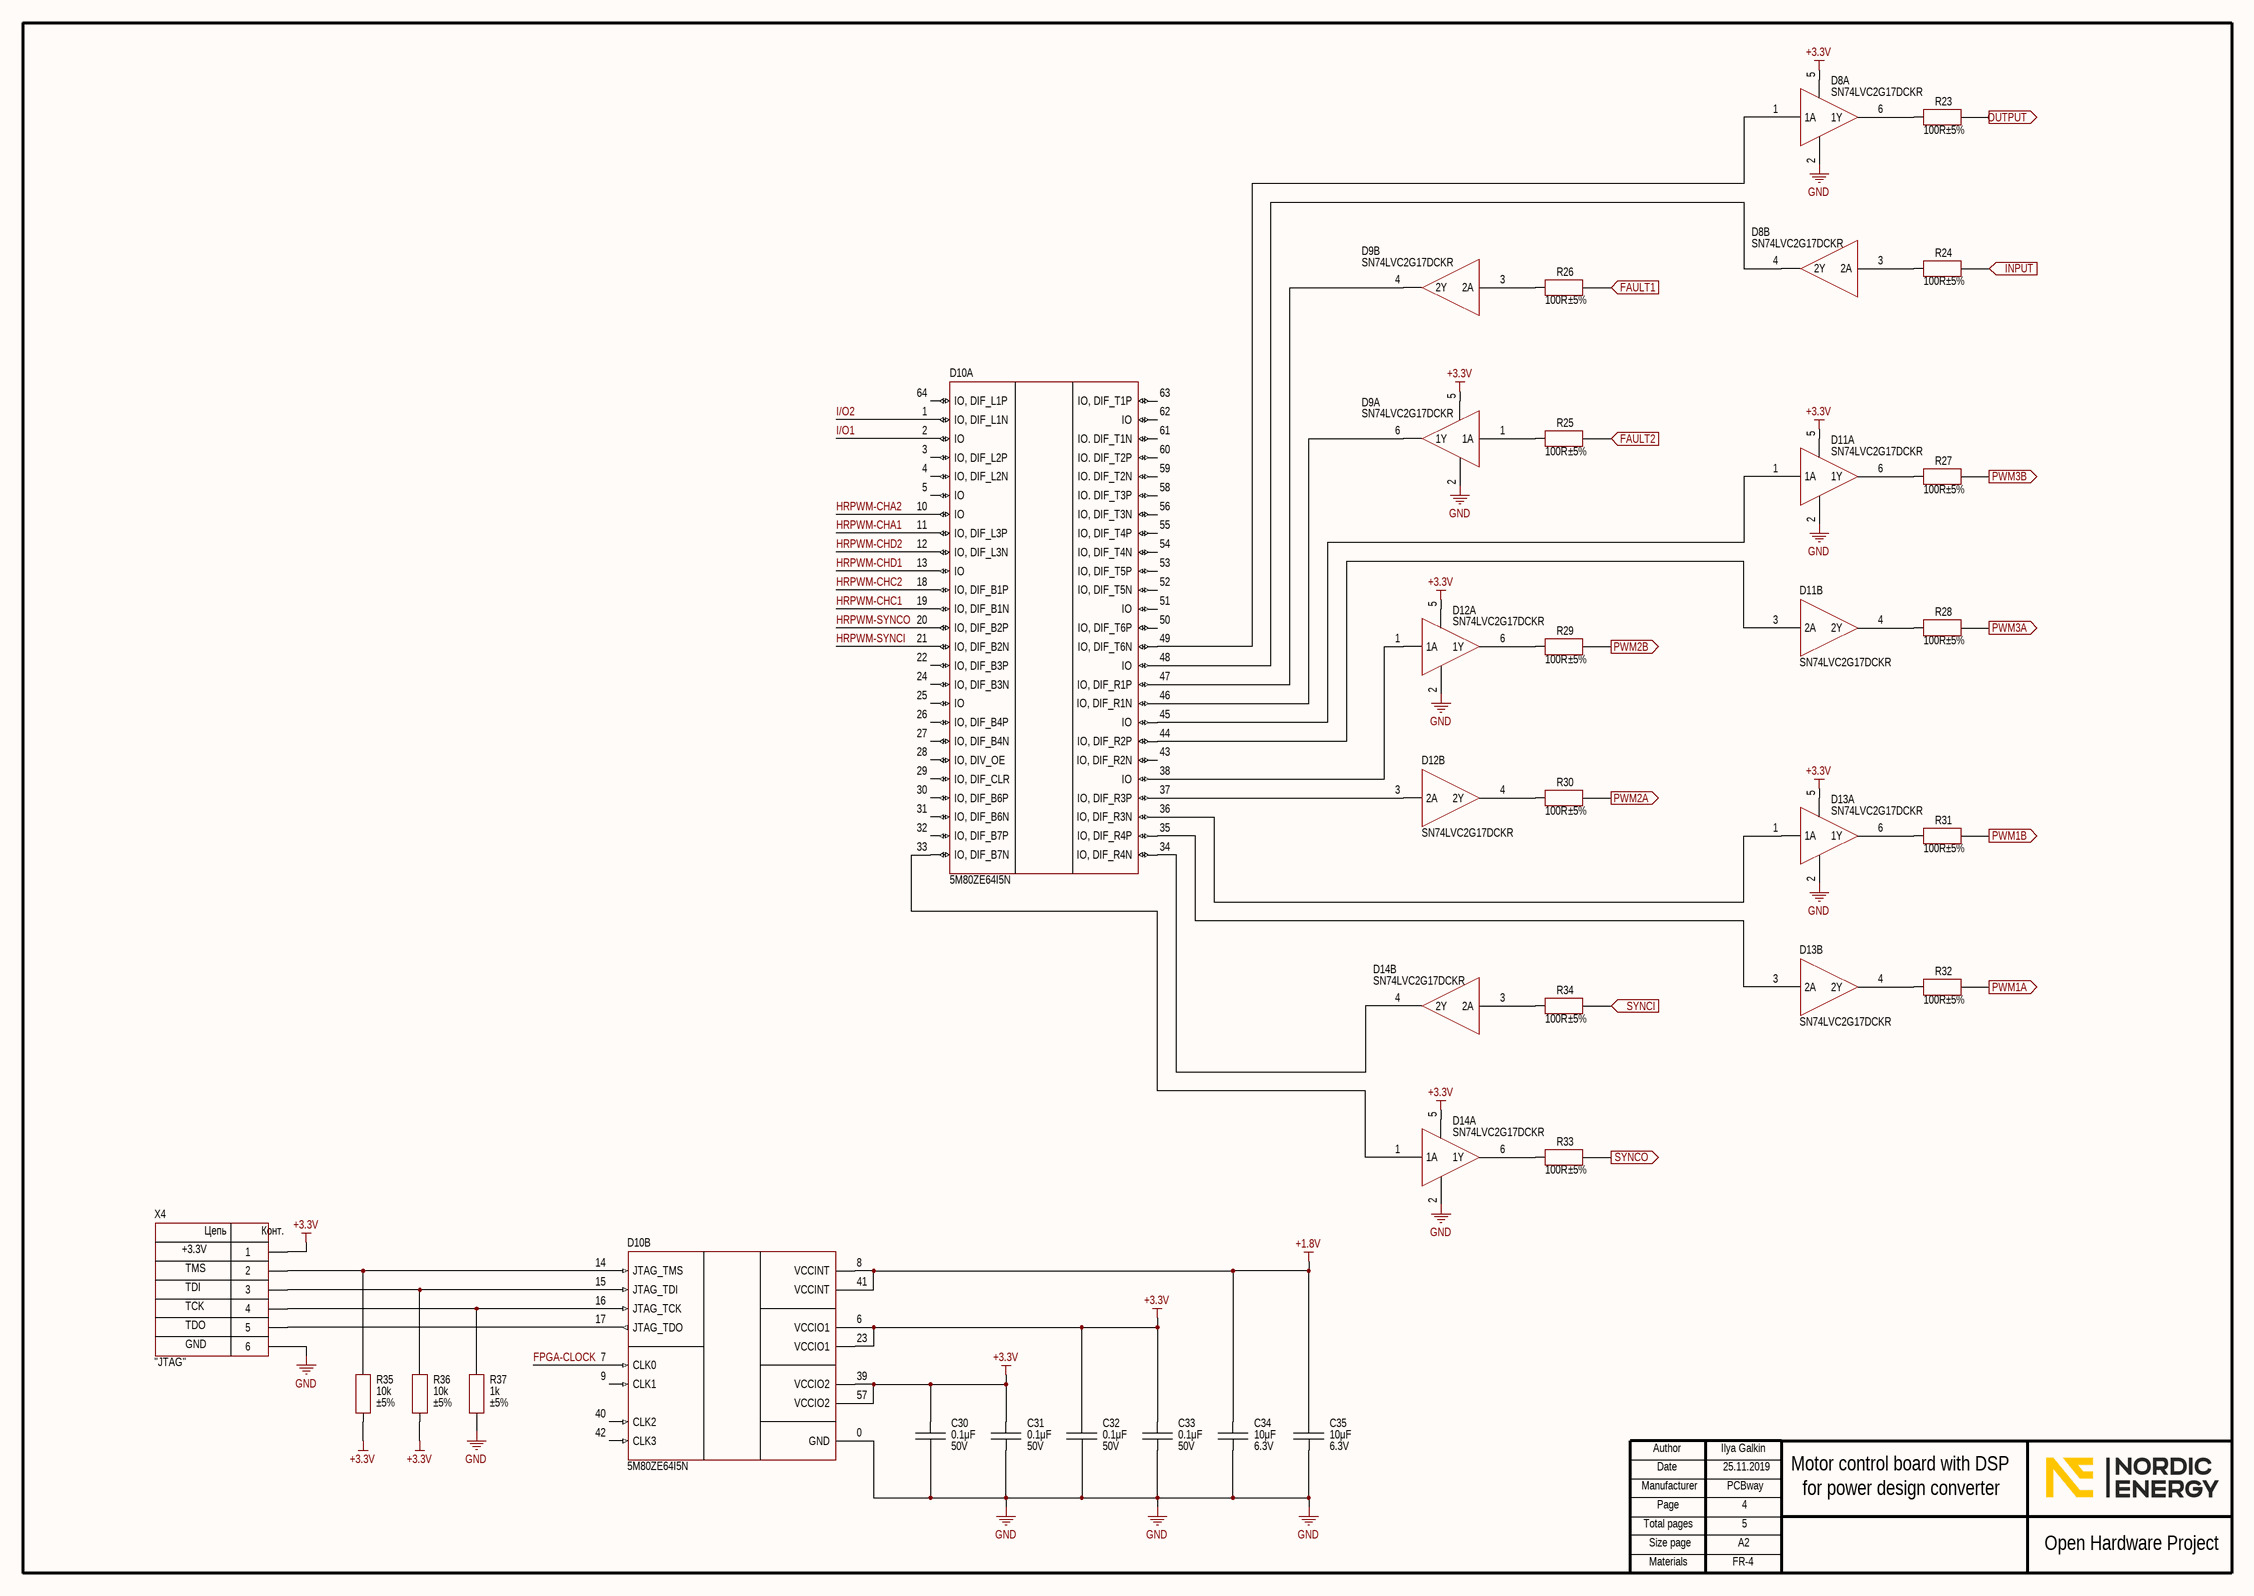
[diagram p3: ProtectionCPLD.SchDoc]

### Parts
C30  value 0.1μF  Voltage: 50V  [CAP: 0603]
C31  value 0.1μF  Voltage: 50V  [CAP: 0603]
C32  value 0.1μF  Voltage: 50V  [CAP: 0603]
C33  value 0.1μF  Voltage: 50V  [CAP: 0603]
C34  value 10μF  Voltage: 6.3V  [CAP: 0603]
C35  value 10μF  Voltage: 6.3V  [CAP: 0603]
D8  (no value)  [SC70-6]  (parts A,B of 2)
D9  (no value)  [SC70-6]  (parts A,B of 2)
D10  (no value)  [64-EQFP]  (parts A,B of 2)
D11  (no value)  [SC70-6]  (parts A,B of 2)
D12  (no value)  [SC70-6]  (parts A,B of 2)
D13  (no value)  [SC70-6]  (parts A,B of 2)
D14  (no value)  [SC70-6]  (parts A,B of 2)
R23  value 100R  Tolerance: ±5%  [RES: 0603]
R24  value 100R  Tolerance: ±5%  [RES: 0603]
R25  value 100R  Tolerance: ±5%  [RES: 0603]
R26  value 100R  Tolerance: ±5%  [RES: 0603]
R27  value 100R  Tolerance: ±5%  [RES: 0603]
R28  value 100R  Tolerance: ±5%  [RES: 0603]
R29  value 100R  Tolerance: ±5%  [RES: 0603]
R30  value 100R  Tolerance: ±5%  [RES: 0603]
R31  value 100R  Tolerance: ±5%  [RES: 0603]
R32  value 100R  Tolerance: ±5%  [RES: 0603]
R33  value 100R  Tolerance: ±5%  [RES: 0603]
R34  value 100R  Tolerance: ±5%  [RES: 0603]
R35  value 10k  Tolerance: ±5%  [RES: 0603]
R36  value 10k  Tolerance: ±5%  [RES: 0603]
R37  value 1k  Tolerance: ±5%  [RES: 0603]
X4  CommentText: "JTAG"  [CON: SM06B-GHS]

### Ports
FAULT1 (in), FAULT2 (in), INPUT (in), OUTPUT (out), PWM1A (out), PWM1B (out), PWM2A (out), PWM2B (out), PWM3A (out), PWM3B (out), SYNCI (in), SYNCO (out)

### Nets
+1.8V: C34.2 C35.2 D10.8(VCCINT) D10.41(VCCINT)
+3.3V: C30.2 C31.2 C32.2 C33.2 D8.5 D9.5 D10.6(VCCIO1) D10.23(VCCIO1) D10.39(VCCIO2) D10.57(VCCIO2) D11.5 D12.5 D13.5 D14.5 R35.1 R36.1 X4.1
GND: C30.1 C31.1 C32.1 C33.1 C34.1 C35.1 D8.2 D9.2 D10.0(GND) D11.2 D12.2 D13.2 D14.2 R37.1 X4.6
FPGA-CLOCK: D10.7(CLK0)
HRPWM-CHA1: D10.11(IO,_DIF_L3P)
HRPWM-CHA2: D10.10(IO)
HRPWM-CHC1: D10.19(IO,_DIF_B1N)
HRPWM-CHC2: D10.18(IO,_DIF_B1P)
HRPWM-CHD1: D10.13(IO)
HRPWM-CHD2: D10.12(IO,_DIF_L3N)
HRPWM-SYNCI: D10.21(IO,_DIF_B2N)
HRPWM-SYNCO: D10.20(IO,_DIF_B2P)
I/O1: D10.2(IO)
I/O2: D10.1(IO,_DIF_L1N)
NetD8_1: D8.1(1A) D10.49(IO,_DIF_T6N)
NetD8_3: D8.3(2A) R24.1
NetD8_4: D8.4(2Y) D10.48(IO)
NetD8_6: D8.6(1Y) R23.1
NetD9_1: D9.1(1A) R25.1
NetD9_3: D9.3(2A) R26.1
NetD9_4: D9.4(2Y) D10.47(IO,_DIF_R1P)
NetD9_6: D9.6(1Y) D10.46(IO,_DIF_R1N)
NetD10_14: D10.14(JTAG_TMS) R35.2 X4.2
NetD10_15: D10.15(JTAG_TDI) R36.2 X4.3
NetD10_16: D10.16(JTAG_TCK) R37.2 X4.4
NetD10_17: D10.17(JTAG_TDO) X4.5
NetD10_33: D10.33(IO,_DIF_B7N) D14.1(1A)
NetD10_34: D10.34(IO,_DIF_R4N) D14.4(2Y)
NetD10_35: D10.35(IO,_DIF_R4P) D13.3(2A)
NetD10_36: D10.36(IO,_DIF_R3N) D13.1(1A)
NetD10_37: D10.37(IO,_DIF_R3P) D12.3(2A)
NetD10_38: D10.38(IO) D12.1(1A)
NetD10_44: D10.44(IO,_DIF_R2P) D11.3(2A)
NetD10_45: D10.45(IO) D11.1(1A)
NetD11_4: D11.4(2Y) R28.1
NetD11_6: D11.6(1Y) R27.1
NetD12_4: D12.4(2Y) R30.1
NetD12_6: D12.6(1Y) R29.1
NetD13_4: D13.4(2Y) R32.1
NetD13_6: D13.6(1Y) R31.1
NetD14_3: D14.3(2A) R34.1
NetD14_6: D14.6(1Y) R33.1
NetR23_2: R23.2 ; port OUTPUT
NetR24_2: R24.2 ; port INPUT
NetR25_2: R25.2 ; port FAULT2
NetR26_2: R26.2 ; port FAULT1
NetR27_2: R27.2 ; port PWM3B
NetR28_2: R28.2 ; port PWM3A
NetR29_2: R29.2 ; port PWM2B
NetR30_2: R30.2 ; port PWM2A
NetR31_2: R31.2 ; port PWM1B
NetR32_2: R32.2 ; port PWM1A
NetR33_2: R33.2 ; port SYNCO
NetR34_2: R34.2 ; port SYNCI

Not connected (* = marked no-connect by the designer): D10 3(IO,_DIF_L2P) 4(IO,_DIF_L2N) 5(IO) 9(CLK1) 22(IO,_DIF_B3P) 24(IO,_DIF_B3N) 25(IO) 26(IO,_DIF_B4P) 27(IO,_DIF_B4N) 28(IO,_DIV_OE) 29(IO,_DIF_CLR) 30(IO,_DIF_B6P) 31(IO,_DIF_B6N) 32(IO,_DIF_B7P) 40(CLK2) 42(CLK3) 43(IO,_DIF_R2N) 50(IO,_DIF_T6P) 51(IO) 52(IO,_DIF_T5N) 53(IO,_DIF_T5P) 54(IO,_DIF_T4N) 55(IO,_DIF_T4P) 56(IO,_DIF_T3N) 58(IO._DIF_T3P) 59(IO._DIF_T2N) 60(IO._DIF_T2P) 61(IO._DIF_T1N) 62(IO) 63(IO,_DIF_T1P) 64(IO,_DIF_L1P)

### Notes on the sheet
- +3.3V
- TMS
- TDI
- TCK
- TDO
- GND
- Ilya Galkin
- 25.11.2019
- PCBway
- 4
- Motor control board with DSP
- for power design converter
- 5
- FR-4
- Author
- Manufacturer
- Date
- Page
- Total pages
- Size page
- A2
- Open Hardware Project
- Materials
- (in symbol Connector_SM06B) Цепь; Конт.

### Library data of the parts
C30-C33 = Ceramic_0603: as C10 on sheet ControllerDSP; Package: 0603; HelpURL: https://www.digikey.com/product-detail/en/samsung-electro-mechanics/CL10B104KB8NNNC/1276-1000-1-ND/3889086; Temperature: -55...+125°C
C34 C35 = Ceramic_0603: as C39 on sheet WiFi; Package: 0603; HelpURL: https://www.digikey.com/product-detail/en/samsung-electro-mechanics/CL10B106MQ8NRNC/1276-1948-1-ND/3890034; Temperature: -55...+125°C
D8 D9 D11-D14 = SN74LVC2G17DCKR: as D6 on sheet ControllerDSP; HelpURL: https://www.digikey.com/product-detail/en/texas-instruments/SN74LVC2G17DCKR/296-13013-1-ND/479736; Package: SC-70-6; ComponentType: IC logic buffer; Temperature: -40...+125°C; PartNumber: SN74LVC2G17DCKR
D10 = 5M80ZE64I5N: CPLD Max V; Manufacturer: Intel; ValueManufacturerPartNumber: IC CPLD logic, MAX V, 100MHz, 80LE, 1.71...1.89V, -40...+100°C, 64-EQFP; Supply: 1.71...1.89V; Speed: 100MHz; LogicElements: 80LE; HelpURL: https://www.digikey.com/product-detail/en/intel/5M80ZE64I5N/544-2817-ND/2660734; Package: 64-EQFP; ComponentType: IC CPLD logic; Temperature: -40...+100°C; Series: MAX V; PartNumber: 5M80ZE64I5N
R23-R34 = Resistor_0603: as R8 on sheet ControllerDSP; Package: 0603; HelpURL: https://www.digikey.com/product-detail/en/yageo/RC0603JR-07100RL/311-100GRCT-ND/729644; Temperature: -55...+125°C
R35 R36 = Resistor_0603: as R6 on sheet ControllerDSP; Package: 0603; HelpURL: https://www.digikey.com/product-detail/en/yageo/RC0603JR-0710KL/311-10KGRCT-ND/729647; Temperature: -55...+125°C
R37 = Resistor_0603: Manufacturer: Yageo; PartNumber: RC0603JR-071KL; ValueManufacturerPartNumber: Resistor film, 1k, ±5%, 0603, 0.1W, -55...+125°C; TypeResistor: Resistor film; Power: 0.1W; Package: 0603; HelpURL: https://www.digikey.com/product-detail/en/yageo/RC0603JR-071KL/311-1.0KGRCT-ND/729624; Temperature: -55...+125°C
X4 = Connector_SM06B: Manufacturer: JST; ValueManufacturerPartNumber: Connector, 6pin, 1.25mm, 50VDC, 1A; PartNumber: SM06B-GHS; VoltageMax: 50VDC; Pitch: 1.25mm; CurrentMax: 1A; Multichannel: 6pin; HelpURL: https://www.digikey.com/product-detail/en/jst-sales-america-inc/SM06B-GHS-TB-LF-SN/455-1568-1-ND/807836; TypeConnector: Connector

## Sheet CanAndSupply.SchDoc
size 420 x 297 mm; Address1: Address1; Address2: Address2; Address3: Address3; Address4: Address4; DocumentNumber: АБВГ.123456.001 Э3; SheetNumber: 5; SheetTotal: 5; Scale: 1:1; DocumentType: Схема электрическая принципиальная; FirstReferrence: АБВГ.123456.001
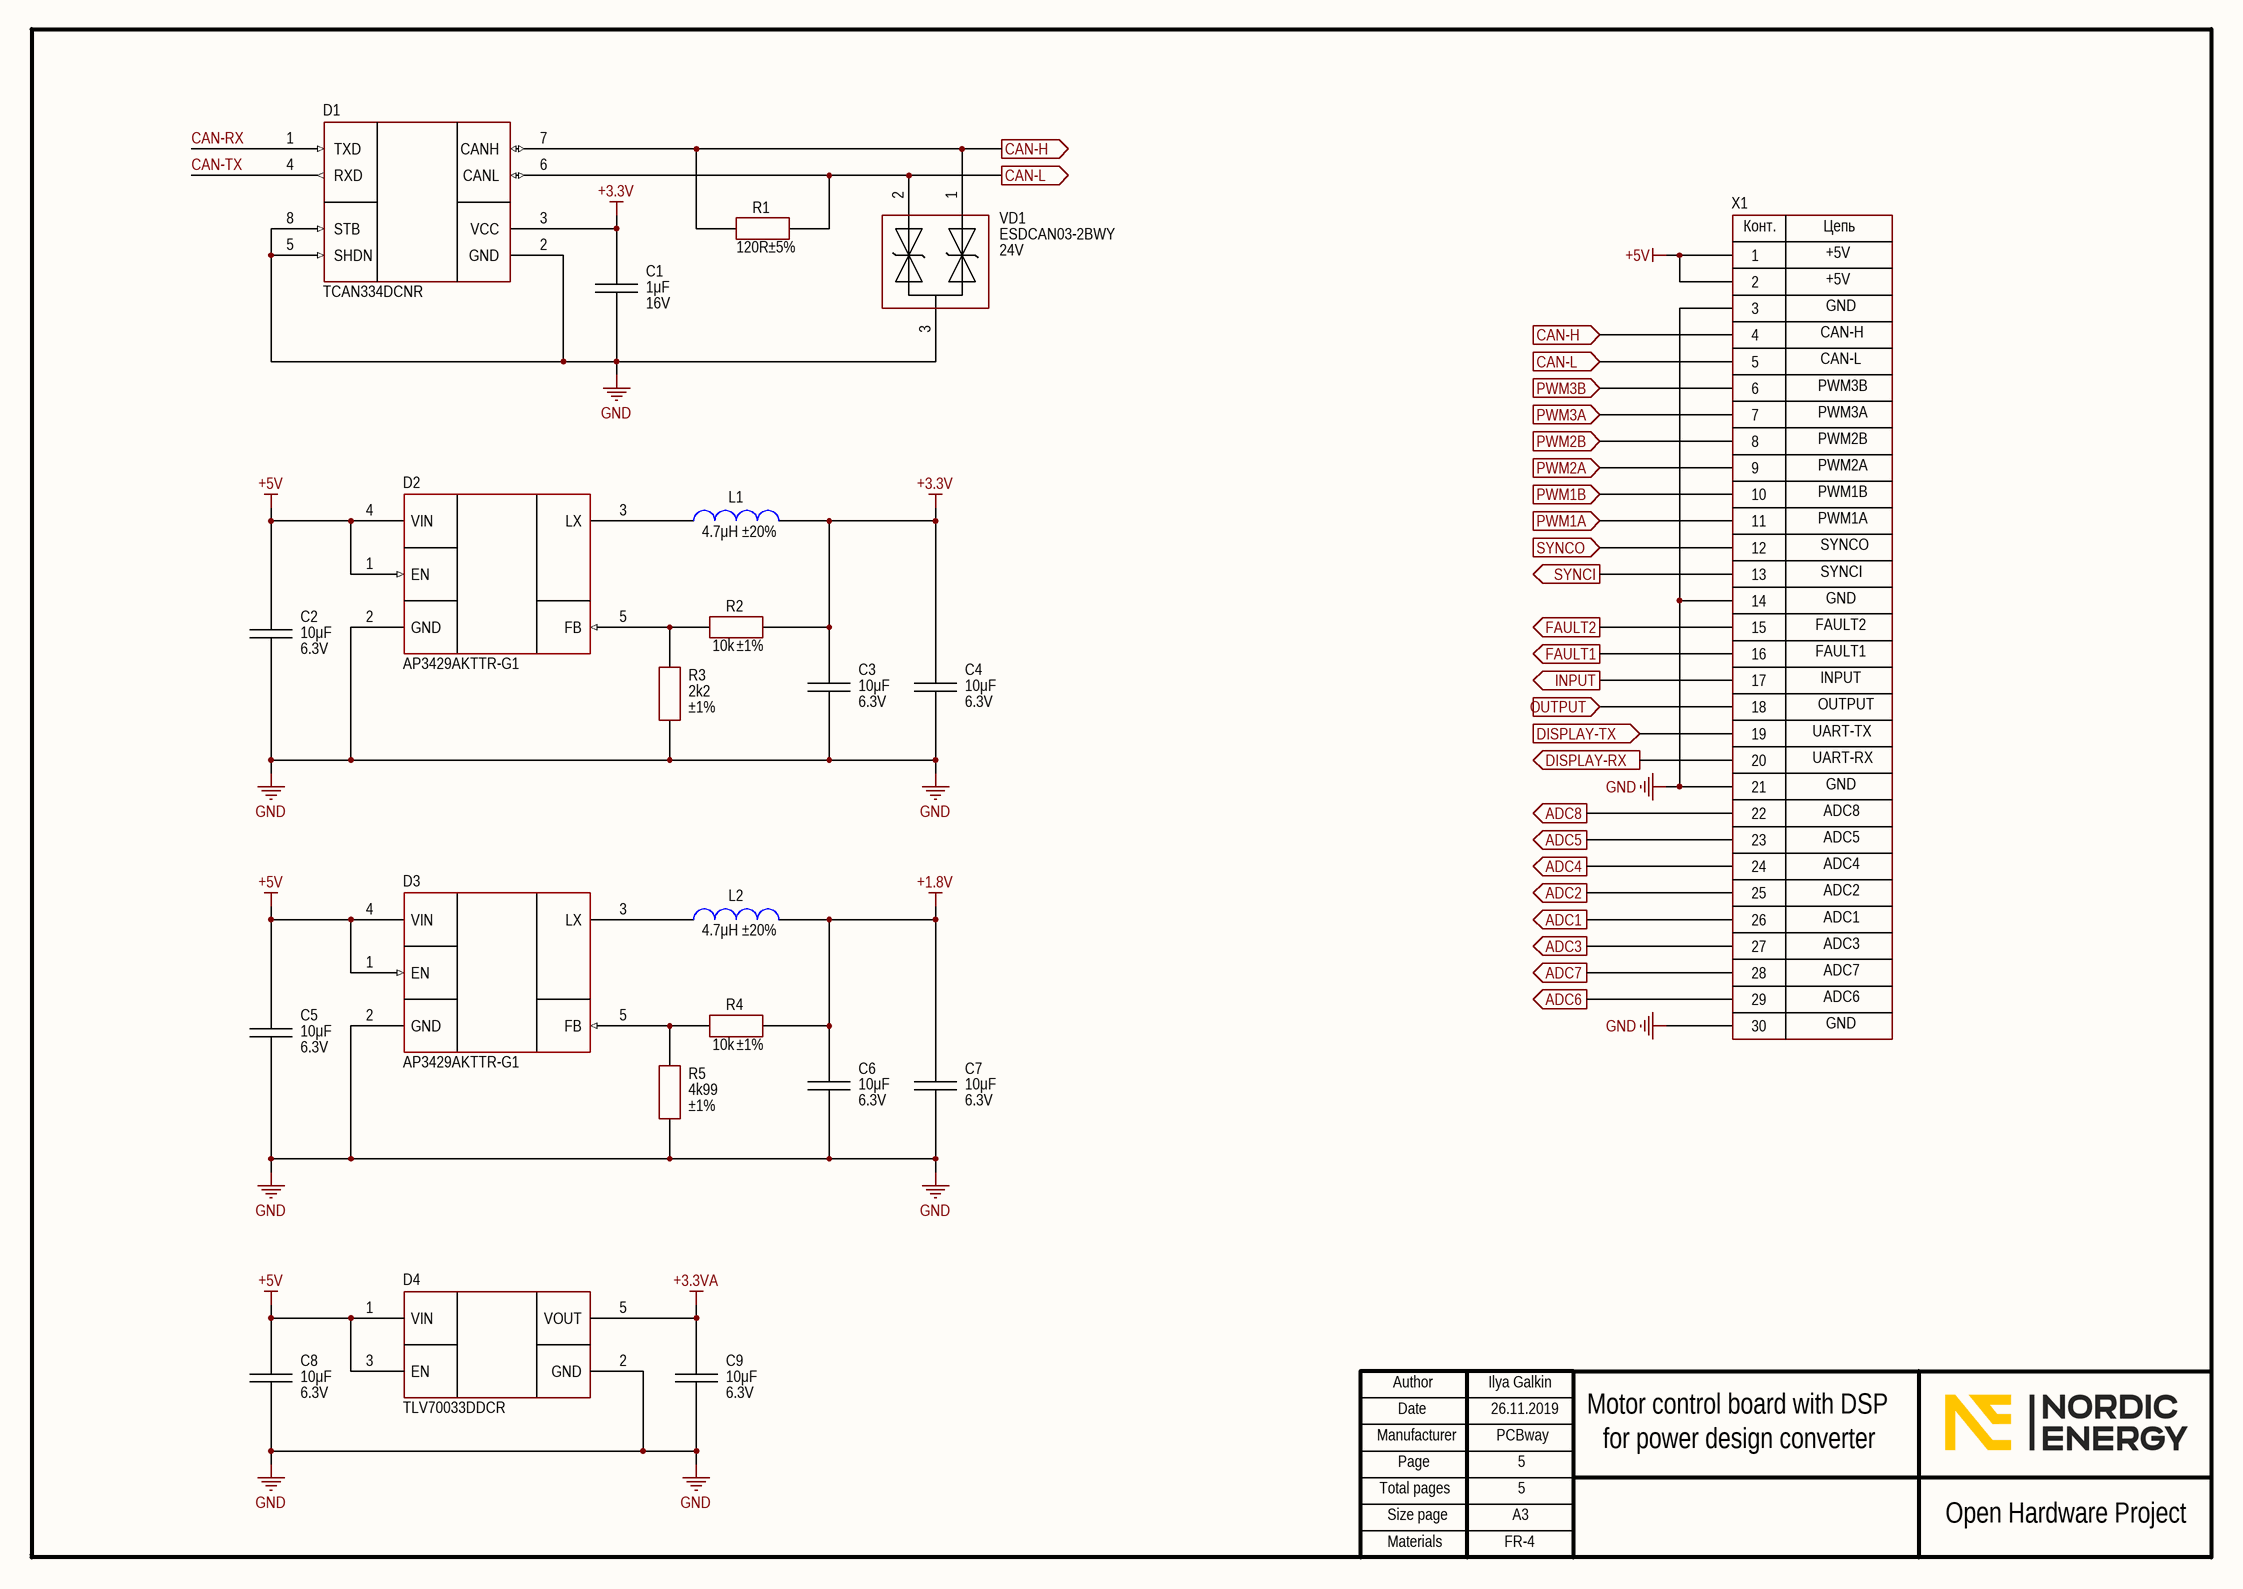
[diagram p4: CanAndSupply.SchDoc]

### Parts
C1  value 1μF  Voltage: 16V  [CAP: 0603]
C2  value 10μF  Voltage: 6.3V  [CAP: 0603]
C3  value 10μF  Voltage: 6.3V  [CAP: 0603]
C4  value 10μF  Voltage: 6.3V  [CAP: 0603]
C5  value 10μF  Voltage: 6.3V  [CAP: 0603]
C6  value 10μF  Voltage: 6.3V  [CAP: 0603]
C7  value 10μF  Voltage: 6.3V  [CAP: 0603]
C8  value 10μF  Voltage: 6.3V  [CAP: 0603]
C9  value 10μF  Voltage: 6.3V  [CAP: 0603]
D1  (no value)  [SOT23-8]
D2  (no value)  [SOT23-5]
D3  (no value)  [SOT23-5]
D4  (no value)  [SOT23-5]
L1  value 4.7μH  Tolerance: ±20%  [IND: SRP2510A]
L2  value 4.7μH  Tolerance: ±20%  [IND: SRP2510A]
R1  value 120R  Tolerance: ±5%  [RES: 0603]
R2  value 10k  Tolerance: ±1%  [RES: 0603]
R3  value 2k2  Tolerance: ±1%  [RES: 0603]
R4  value 10k  Tolerance: ±1%  [RES: 0603]
R5  value 4k99  Tolerance: ±1%  [RES: 0603]
VD1  Voltage: 24V  PartNumber: ESDCAN03-2BWY  [SC-70]
X1  (no value)  [CON: PLS-30R]

### Ports
ADC1 (out), ADC2 (out), ADC3 (out), ADC4 (out), ADC5 (out), ADC6 (out), ADC7 (out), ADC8 (out), CAN-H (in), CAN-H (out), CAN-L (in), CAN-L (out), DISPLAY-RX (out), DISPLAY-TX (in), FAULT1 (out), FAULT2 (out), INPUT (out), OUTPUT (in), PWM1A (in), PWM1B (in), PWM2A (in), PWM2B (in), PWM3A (in), PWM3B (in), SYNCI (out), SYNCO (in)

### Nets
+1.8V: C6.2 C7.2 L2.1 R4.1
+3.3V: C1.2 C3.2 C4.2 D1.3(VCC) L1.1 R2.1
+3.3VA: C9.2 D4.5(VOUT)
+5V: C2.2 C5.2 C8.2 D2.1(EN) D2.4(VIN) D3.1(EN) D3.4(VIN) D4.1(VIN) D4.3(EN) X1.1 X1.2
GND: C1.1 C2.1 C3.1 C4.1 C5.1 C6.1 C7.1 C8.1 C9.1 D1.2(GND) D1.5(SHDN) D1.8(STB) D2.2(GND) D3.2(GND) D4.2(GND) R3.1 R5.1 VD1.3 X1.3 X1.14 X1.21 X1.30
CAN-RX: D1.1(TXD)
CAN-TX: D1.4(RXD)
NetD1_6: D1.6(CANL) R1.2 VD1.2 X1.5 ; port CAN-L
NetD1_7: D1.7(CANH) R1.1 VD1.1 X1.4 ; port CAN-H
NetD2_3: D2.3(LX) L1.2
NetD2_5: D2.5(FB) R2.2 R3.2
NetD3_3: D3.3(LX) L2.2
NetD3_5: D3.5(FB) R4.2 R5.2
NetR9_2: X1.20 ; port DISPLAY-RX
NetR13_2: X1.19 ; port DISPLAY-TX
NetR15_2: X1.26 ; port ADC1
NetR16_2: X1.23 ; port ADC5
NetR17_2: X1.25 ; port ADC2
NetR18_2: X1.29 ; port ADC6
NetR19_2: X1.27 ; port ADC3
NetR20_2: X1.28 ; port ADC7
NetR21_2: X1.24 ; port ADC4
NetR22_2: X1.22 ; port ADC8
NetR23_2: X1.18 ; port OUTPUT
NetR24_2: X1.17 ; port INPUT
NetR25_2: X1.15 ; port FAULT2
NetR26_2: X1.16 ; port FAULT1
NetR27_2: X1.6 ; port PWM3B
NetR28_2: X1.7 ; port PWM3A
NetR29_2: X1.8 ; port PWM2B
NetR30_2: X1.9 ; port PWM2A
NetR31_2: X1.10 ; port PWM1B
NetR32_2: X1.11 ; port PWM1A
NetR33_2: X1.12 ; port SYNCO
NetR34_2: X1.13 ; port SYNCI

### Notes on the sheet
- +5V
- GND
- PWM3B
- CAN-H
- CAN-L
- PWM2B
- PWM3A
- PWM1A
- PWM1B
- PWM2A
- SYNCI
- SYNCO
- FAULT1
- FAULT2
- OUTPUT
- INPUT
- UART-TX
- UART-RX
- ADC8
- ADC5
- ADC4
- ADC2
- ADC1
- ADC7
- ADC6
- ADC3
- Ilya Galkin
- 26.11.2019
- PCBway
- 5
- Motor control board with DSP
- for power design converter
- FR-4
- Author
- Manufacturer
- Date
- Page
- Total pages
- Size page
- A3
- Open Hardware Project
- Materials
- (in symbol PLS-30) Конт.; Цепь

### Library data of the parts
C1 = Ceramic_0603: as C16 on sheet ControllerDSP; Package: 0603; HelpURL: https://www.digikey.com/product-detail/en/samsung-electro-mechanics/CL10B105KO8NNNC/1276-1019-1-ND/3889105; Temperature: -55...+125°C
C2-C9 = Ceramic_0603: as C39 on sheet WiFi; Package: 0603; HelpURL: https://www.digikey.com/product-detail/en/samsung-electro-mechanics/CL10B106MQ8NRNC/1276-1948-1-ND/3890034; Temperature: -55...+125°C
D1 = TCAN334DCNR: CAN; Manufacturer: Texas Instruments; ValueManufacturerPartNumber: IC CAN transceiver, 1Mbps, Half-duplex, 3...3.6V, -40...+125°C, SOT23-8; Supply: 3...3.6V; DataRate: 1Mbps; TypeDuplex: Half-duplex; HelpURL: https://www.digikey.com/product-detail/en/texas-instruments/TCAN334DCNR/296-47830-1-ND/8133179; Package: SOT23-8; ComponentType: IC CAN transceiver; Temperature: -40...+125°C; PartNumber: TCAN334DCNR
D2 D3 = AP3429AKTTR-G1: Buck converter; Manufacturer: Diodes Incorporated; ValueManufacturerPartNumber: DC/DC buck converter, input 2.7...5.5V, 1MHz, output 0.6...5V, 2A, -40...+85°C, SOT23-6; VoltageInput: input 2.7...5.5V; Frequency: 1MHz; CurrentOutput: 2A; VoltageOutput: output 0.6...5V; HelpURL: https://www.digikey.com/product-detail/en/diodes-incorporated/AP3429AKTTR-G1/AP3429AKTTR-G1DICT-ND/5359842; Package: SOT23-6; ComponentType: DC/DC buck converter; Temperature: -40...+85°C; PartNumber: AP3429AKTTR-G1
D4 = TLV70033DDCR: Linear voltage regulator; Manufacturer: Texas Instruments; ValueManufacturerPartNumber: Linear voltage regulator, input 5.5V, 0.25V, output 3.3V, 200 mA, -40...+85°C, SOT-23-5; VoltageInput: input 5.5V; MaxDropout: 0.25V; CurrentOutput: 200 mA; VoltageOutput: output 3.3V; HelpURL: https://www.digikey.com/product-detail/en/texas-instruments/TLV70033DDCR/296-27937-1-ND/2440840; Package: SOT-23-5; ComponentType: Linear voltage regulator; Temperature: -40...+85°C; PartNumber: TLV70033DDCR
L1 L2 = Inductor_SRP2510A: Manufacturer: Bourns; PartNumber: SRP2510A-4R7M; ValueManufacturerPartNumber: Fixed inductor, 4.7μH, ±20%, SRP2510A, 1.36A, -40...+125°C; TypeInductor: Fixed inductor; MaxCurrent: 1.36A; Package: SRP2510A; HelpURL: https://www.digikey.com/product-detail/en/bourns-inc/SRP2510A-4R7M/SRP2510A-4R7MCT-ND/7354840; Temperature: -40...+125°C
R1 = Resistor_0603: Manufacturer: Yageo; PartNumber: RC0603JR-07120RL; ValueManufacturerPartNumber: Resistor film, 120R, ±5%, 0603, 0.1W, -55...+125°C; TypeResistor: Resistor film; Power: 0.1W; Package: 0603; HelpURL: https://www.digikey.com/product-detail/en/yageo/RC0603JR-07120RL/311-120GRCT-ND/729653; Temperature: -55...+125°C
R2 R4 = Resistor_0603: Manufacturer: Yageo; PartNumber: RC0603FR-0710KL; ValueManufacturerPartNumber: Resistor film, 10k, ±1%, 0603, 0.1W, -55...+125°C; TypeResistor: Resistor film; Power: 0.1W; Package: 0603; HelpURL: https://www.digikey.com/product-detail/en/yageo/RC0603FR-0710KL/311-10.0KHRCT-ND/729827; Temperature: -55...+125°C
R3 = Resistor_0603: Manufacturer: Yageo; PartNumber: RC0603FR-072K2L; ValueManufacturerPartNumber: Resistor film, 2k2, ±1%, 0603, 0.1W, -55...+125°C; TypeResistor: Resistor film; Power: 0.1W; Package: 0603; HelpURL: https://www.digikey.com/product-detail/en/yageo/RC0603FR-072K2L/311-2.20KHRCT-ND/729963; Temperature: -55...+125°C
R5 = Resistor_0603: Manufacturer: Yageo; PartNumber: RC0603FR-074K99L; ValueManufacturerPartNumber: Resistor film, 4k99, ±1%, 0603, 0.1W, -55...+125°C; TypeResistor: Resistor film; Power: 0.1W; Package: 0603; HelpURL: https://www.digikey.com/product-detail/en/yageo/RC0603FR-074K99L/311-4.99KHRCT-ND/730166; Temperature: -55...+125°C
VD1 = TVS_array: Manufacturer: Texas Instruments; ValueManufacturerPartNumber: Zener diode, 24V, 250W, 3A peak, 3pF, SC-70, -55...+175°C; TypeDiode: Zener diode; Current: 250W; VoltageDrop: 3A peak; RecoveryTime: 3pF; Package: SC-70; HelpURL: https://www.digikey.com/product-detail/en/stmicroelectronics/ESDCAN03-2BWY/497-15846-1-ND/5305256; Temperature: -55...+175°C
X1 = PLS-30: Manufacturer: Connfly; ValueManufacturerPartNumber: Connector, 30pin, 2.54mm, 500VAC, 3A; TypeConnector: Connector; VoltageMax: 500VAC; Pitch: 2.54mm; CurrentMax: 3A; Multichannel: 30pin; CommentText: "Разъем"; HelpURL: https://www.chipdip.ru/product/pls-40r-2; PartNumber: PLS-30

## Nets that join several sheets
+1.8V: ProtectionCPLD (C34.2 C35.2 D10.8 D10.41), CanAndSupply (C6.2 C7.2 L2.1 R4.1)
+3.3V: ControllerDSP (15 pins), ProtectionADC (8 pins), WiFi (11 pins), ProtectionCPLD (17 pins), CanAndSupply (6 pins)
+3.3VA: ControllerDSP (C17.2 L3.1), CanAndSupply (C9.2 D4.5)
GND: ControllerDSP (25 pins), ProtectionADC (16 pins), WiFi (7 pins), ProtectionCPLD (15 pins), CanAndSupply (22 pins)
ADC1-IN1: ControllerDSP (D5.10), ProtectionADC (C22.2 R15.1)
ADC1-IN2: ControllerDSP (D5.11), ProtectionADC (C24.2 R17.1)
ADC1-IN3: ControllerDSP (D5.12), ProtectionADC (C26.2 R19.1)
ADC1-IN4: ControllerDSP (D5.13), ProtectionADC (C28.2 R21.1)
ADC2-IN1: ControllerDSP (D5.14), ProtectionADC (C23.2 R16.1)
ADC2-IN2: ControllerDSP (D5.15), ProtectionADC (C25.2 R18.1)
ADC2-IN3: ControllerDSP (D5.16), ProtectionADC (C27.2 R20.1)
ADC2-IN4: ControllerDSP (D5.17), ProtectionADC (C29.2 R22.1)
CAN-RX: ControllerDSP (D5.32), CanAndSupply (D1.1)
CAN-TX: ControllerDSP (D5.33), CanAndSupply (D1.4)
FPGA-CLOCK: ControllerDSP (D5.31), ProtectionCPLD (D10.7)
HRPWM-CHA1: ControllerDSP (D5.29), ProtectionCPLD (D10.11)
HRPWM-CHA2: ControllerDSP (D5.30), ProtectionCPLD (D10.10)
HRPWM-CHC1: ControllerDSP (D5.25), ProtectionCPLD (D10.19)
HRPWM-CHC2: ControllerDSP (D5.26), ProtectionCPLD (D10.18)
HRPWM-CHD1: ControllerDSP (D5.27), ProtectionCPLD (D10.13)
HRPWM-CHD2: ControllerDSP (D5.28), ProtectionCPLD (D10.12)
HRPWM-SYNCI: ControllerDSP (D5.20), ProtectionCPLD (D10.21)
HRPWM-SYNCO: ControllerDSP (D5.19), ProtectionCPLD (D10.20)
I/O1: ControllerDSP (D5.41), ProtectionCPLD (D10.2)
I/O2: ControllerDSP (D5.38), ProtectionCPLD (D10.1)
NetR9_2: ControllerDSP (R9.2), CanAndSupply (X1.20)
NetR13_2: ControllerDSP (R13.2), CanAndSupply (X1.19)
NetR15_2: ProtectionADC (R15.2 VD5.3), CanAndSupply (X1.26)
NetR16_2: ProtectionADC (R16.2 VD6.3), CanAndSupply (X1.23)
NetR17_2: ProtectionADC (R17.2 VD7.3), CanAndSupply (X1.25)
NetR18_2: ProtectionADC (R18.2 VD8.3), CanAndSupply (X1.29)
NetR19_2: ProtectionADC (R19.2 VD9.3), CanAndSupply (X1.27)
NetR20_2: ProtectionADC (R20.2 VD10.3), CanAndSupply (X1.28)
NetR21_2: ProtectionADC (R21.2 VD11.3), CanAndSupply (X1.24)
NetR22_2: ProtectionADC (R22.2 VD12.3), CanAndSupply (X1.22)
NetR23_2: ProtectionCPLD (R23.2), CanAndSupply (X1.18)
NetR24_2: ProtectionCPLD (R24.2), CanAndSupply (X1.17)
NetR25_2: ProtectionCPLD (R25.2), CanAndSupply (X1.15)
NetR26_2: ProtectionCPLD (R26.2), CanAndSupply (X1.16)
NetR27_2: ProtectionCPLD (R27.2), CanAndSupply (X1.6)
NetR28_2: ProtectionCPLD (R28.2), CanAndSupply (X1.7)
NetR29_2: ProtectionCPLD (R29.2), CanAndSupply (X1.8)
NetR30_2: ProtectionCPLD (R30.2), CanAndSupply (X1.9)
NetR31_2: ProtectionCPLD (R31.2), CanAndSupply (X1.10)
NetR32_2: ProtectionCPLD (R32.2), CanAndSupply (X1.11)
NetR33_2: ProtectionCPLD (R33.2), CanAndSupply (X1.12)
NetR34_2: ProtectionCPLD (R34.2), CanAndSupply (X1.13)
UART2-RX-WIFI: ControllerDSP (D5.40), WiFi (D15.41)
UART2-TX-WIFI: ControllerDSP (D5.39), WiFi (D15.40)